# Altium project Arria10_NetBoard.PrjPcb (part 2 of 2)

## Sheet [10] - FPGA IO BANK 3A.SchDoc
size A3; DocumentNumber: 10; SheetNumber: 10; SheetTotal: 15
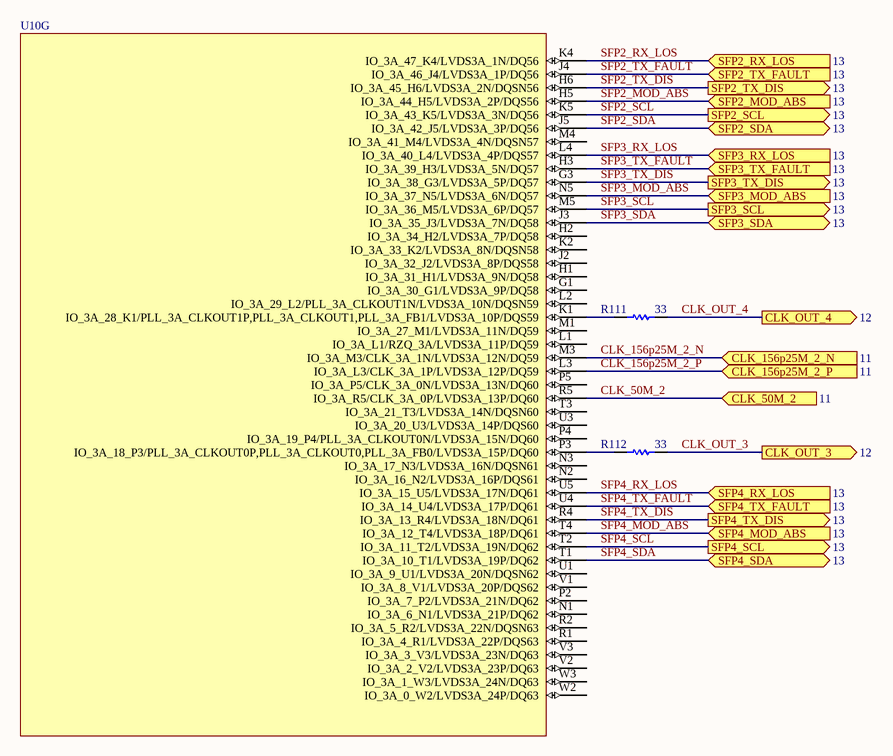
[diagram p9: [10] - FPGA IO BANK 3A.SchDoc]

### Parts
R111  33  [0402_R]
R112  33  [0402_R]
U10  10AX016 F27  [FBGA672]  (value not drawn)  (part G of 12)

### Ports
CLK_50M_2 (in, see 11), CLK_156p25M_2_N (in, see 11), CLK_156p25M_2_P (in, see 11), CLK_OUT_3 (out, see 12), CLK_OUT_4 (out, see 12), SFP2_MOD_ABS (in, see 13), SFP2_RX_LOS (in, see 13), SFP2_SCL (out, see 13), SFP2_SDA (bidir, see 13), SFP2_TX_DIS (out, see 13), SFP2_TX_FAULT (in, see 13), SFP3_MOD_ABS (in, see 13), SFP3_RX_LOS (in, see 13), SFP3_SCL (out, see 13), SFP3_SDA (bidir, see 13), SFP3_TX_DIS (out, see 13), SFP3_TX_FAULT (in, see 13), SFP4_MOD_ABS (in, see 13), SFP4_RX_LOS (in, see 13), SFP4_SCL (out, see 13), SFP4_SDA (bidir, see 13), SFP4_TX_DIS (out, see 13), SFP4_TX_FAULT (in, see 13)

### Nets
CLK_50M_2: U10.R5(IO_3A_R5/CLK_3A_0P/LVDS3A_13P/DQ60) ; port CLK_50M_2
CLK_156p25M_2_N: U10.M3(IO_3A_M3/CLK_3A_1N/LVDS3A_12N/DQ59) ; port CLK_156p25M_2_N
CLK_156p25M_2_P: U10.L3(IO_3A_L3/CLK_3A_1P/LVDS3A_12P/DQ59) ; port CLK_156p25M_2_P
CLK_OUT_3: R112.2 ; port CLK_OUT_3
CLK_OUT_4: R111.2 ; port CLK_OUT_4
SFP2_MOD_ABS: U10.H5(IO_3A_44_H5/LVDS3A_2P/DQS56) ; port SFP2_MOD_ABS
SFP2_RX_LOS: U10.K4(IO_3A_47_K4/LVDS3A_1N/DQ56) ; port SFP2_RX_LOS
SFP2_SCL: U10.K5(IO_3A_43_K5/LVDS3A_3N/DQ56) ; port SFP2_SCL
SFP2_SDA: U10.J5(IO_3A_42_J5/LVDS3A_3P/DQ56) ; port SFP2_SDA
SFP2_TX_DIS: U10.H6(IO_3A_45_H6/LVDS3A_2N/DQSN56) ; port SFP2_TX_DIS
SFP2_TX_FAULT: U10.J4(IO_3A_46_J4/LVDS3A_1P/DQ56) ; port SFP2_TX_FAULT
SFP3_MOD_ABS: U10.N5(IO_3A_37_N5/LVDS3A_6N/DQ57) ; port SFP3_MOD_ABS
SFP3_RX_LOS: U10.L4(IO_3A_40_L4/LVDS3A_4P/DQS57) ; port SFP3_RX_LOS
SFP3_SCL: U10.M5(IO_3A_36_M5/LVDS3A_6P/DQ57) ; port SFP3_SCL
SFP3_SDA: U10.J3(IO_3A_35_J3/LVDS3A_7N/DQ58) ; port SFP3_SDA
SFP3_TX_DIS: U10.G3(IO_3A_38_G3/LVDS3A_5P/DQ57) ; port SFP3_TX_DIS
SFP3_TX_FAULT: U10.H3(IO_3A_39_H3/LVDS3A_5N/DQ57) ; port SFP3_TX_FAULT
SFP4_MOD_ABS: U10.T4(IO_3A_12_T4/LVDS3A_18P/DQ61) ; port SFP4_MOD_ABS
SFP4_RX_LOS: U10.U5(IO_3A_15_U5/LVDS3A_17N/DQ61) ; port SFP4_RX_LOS
SFP4_SCL: U10.T2(IO_3A_11_T2/LVDS3A_19N/DQ62) ; port SFP4_SCL
SFP4_SDA: U10.T1(IO_3A_10_T1/LVDS3A_19P/DQ62) ; port SFP4_SDA
SFP4_TX_DIS: U10.R4(IO_3A_13_R4/LVDS3A_18N/DQ61) ; port SFP4_TX_DIS
SFP4_TX_FAULT: U10.U4(IO_3A_14_U4/LVDS3A_17P/DQ61) ; port SFP4_TX_FAULT
NetR111_1: R111.1 U10.K1(IO_3A_28_K1/PLL_3A_CLKOUT1P,PLL_3A_CLKOUT1,PLL_3A_FB1/LVDS3A_10P/DQS59)
NetR112_1: R112.1 U10.P3(IO_3A_18_P3/PLL_3A_CLKOUT0P,PLL_3A_CLKOUT0,PLL_3A_FB0/LVDS3A_15P/DQ60)

Not connected (* = marked no-connect by the designer): U10 G1(IO_3A_30_G1/LVDS3A_9P/DQ58) H1(IO_3A_31_H1/LVDS3A_9N/DQ58) H2(IO_3A_34_H2/LVDS3A_7P/DQ58) J2(IO_3A_32_J2/LVDS3A_8P/DQS58) K2(IO_3A_33_K2/LVDS3A_8N/DQSN58) L1(IO_3A_L1/RZQ_3A/LVDS3A_11P/DQ59) L2(IO_3A_29_L2/PLL_3A_CLKOUT1N/LVDS3A_10N/DQSN59) M1(IO_3A_27_M1/LVDS3A_11N/DQ59) M4(IO_3A_41_M4/LVDS3A_4N/DQSN57) N1(IO_3A_6_N1/LVDS3A_21P/DQ62) N2(IO_3A_16_N2/LVDS3A_16P/DQS61) N3(IO_3A_17_N3/LVDS3A_16N/DQSN61) P2(IO_3A_7_P2/LVDS3A_21N/DQ62) P4(IO_3A_19_P4/PLL_3A_CLKOUT0N/LVDS3A_15N/DQ60) P5(IO_3A_P5/CLK_3A_0N/LVDS3A_13N/DQ60) R1(IO_3A_4_R1/LVDS3A_22P/DQS63) R2(IO_3A_5_R2/LVDS3A_22N/DQSN63) T3(IO_3A_21_T3/LVDS3A_14N/DQSN60) U1(IO_3A_9_U1/LVDS3A_20N/DQSN62) U3(IO_3A_20_U3/LVDS3A_14P/DQS60) V1(IO_3A_8_V1/LVDS3A_20P/DQS62) V2(IO_3A_2_V2/LVDS3A_23P/DQ63) V3(IO_3A_3_V3/LVDS3A_23N/DQ63) W2(IO_3A_0_W2/LVDS3A_24P/DQ63) W3(IO_3A_1_W3/LVDS3A_24N/DQ63)

### Library data of the parts
R111 R112 = Res SMD: SMD Resistor; Tolerance: 5%; Value: 33; Manufacturer Part Num: *
U10 = 10AX016: Value: 10AX016 F27; Manufacturer Part Num: *

## Sheet [11] - MAIN CLOCKS.SchDoc
size A3; DocumentNumber: 11; SheetNumber: 11; SheetTotal: 15
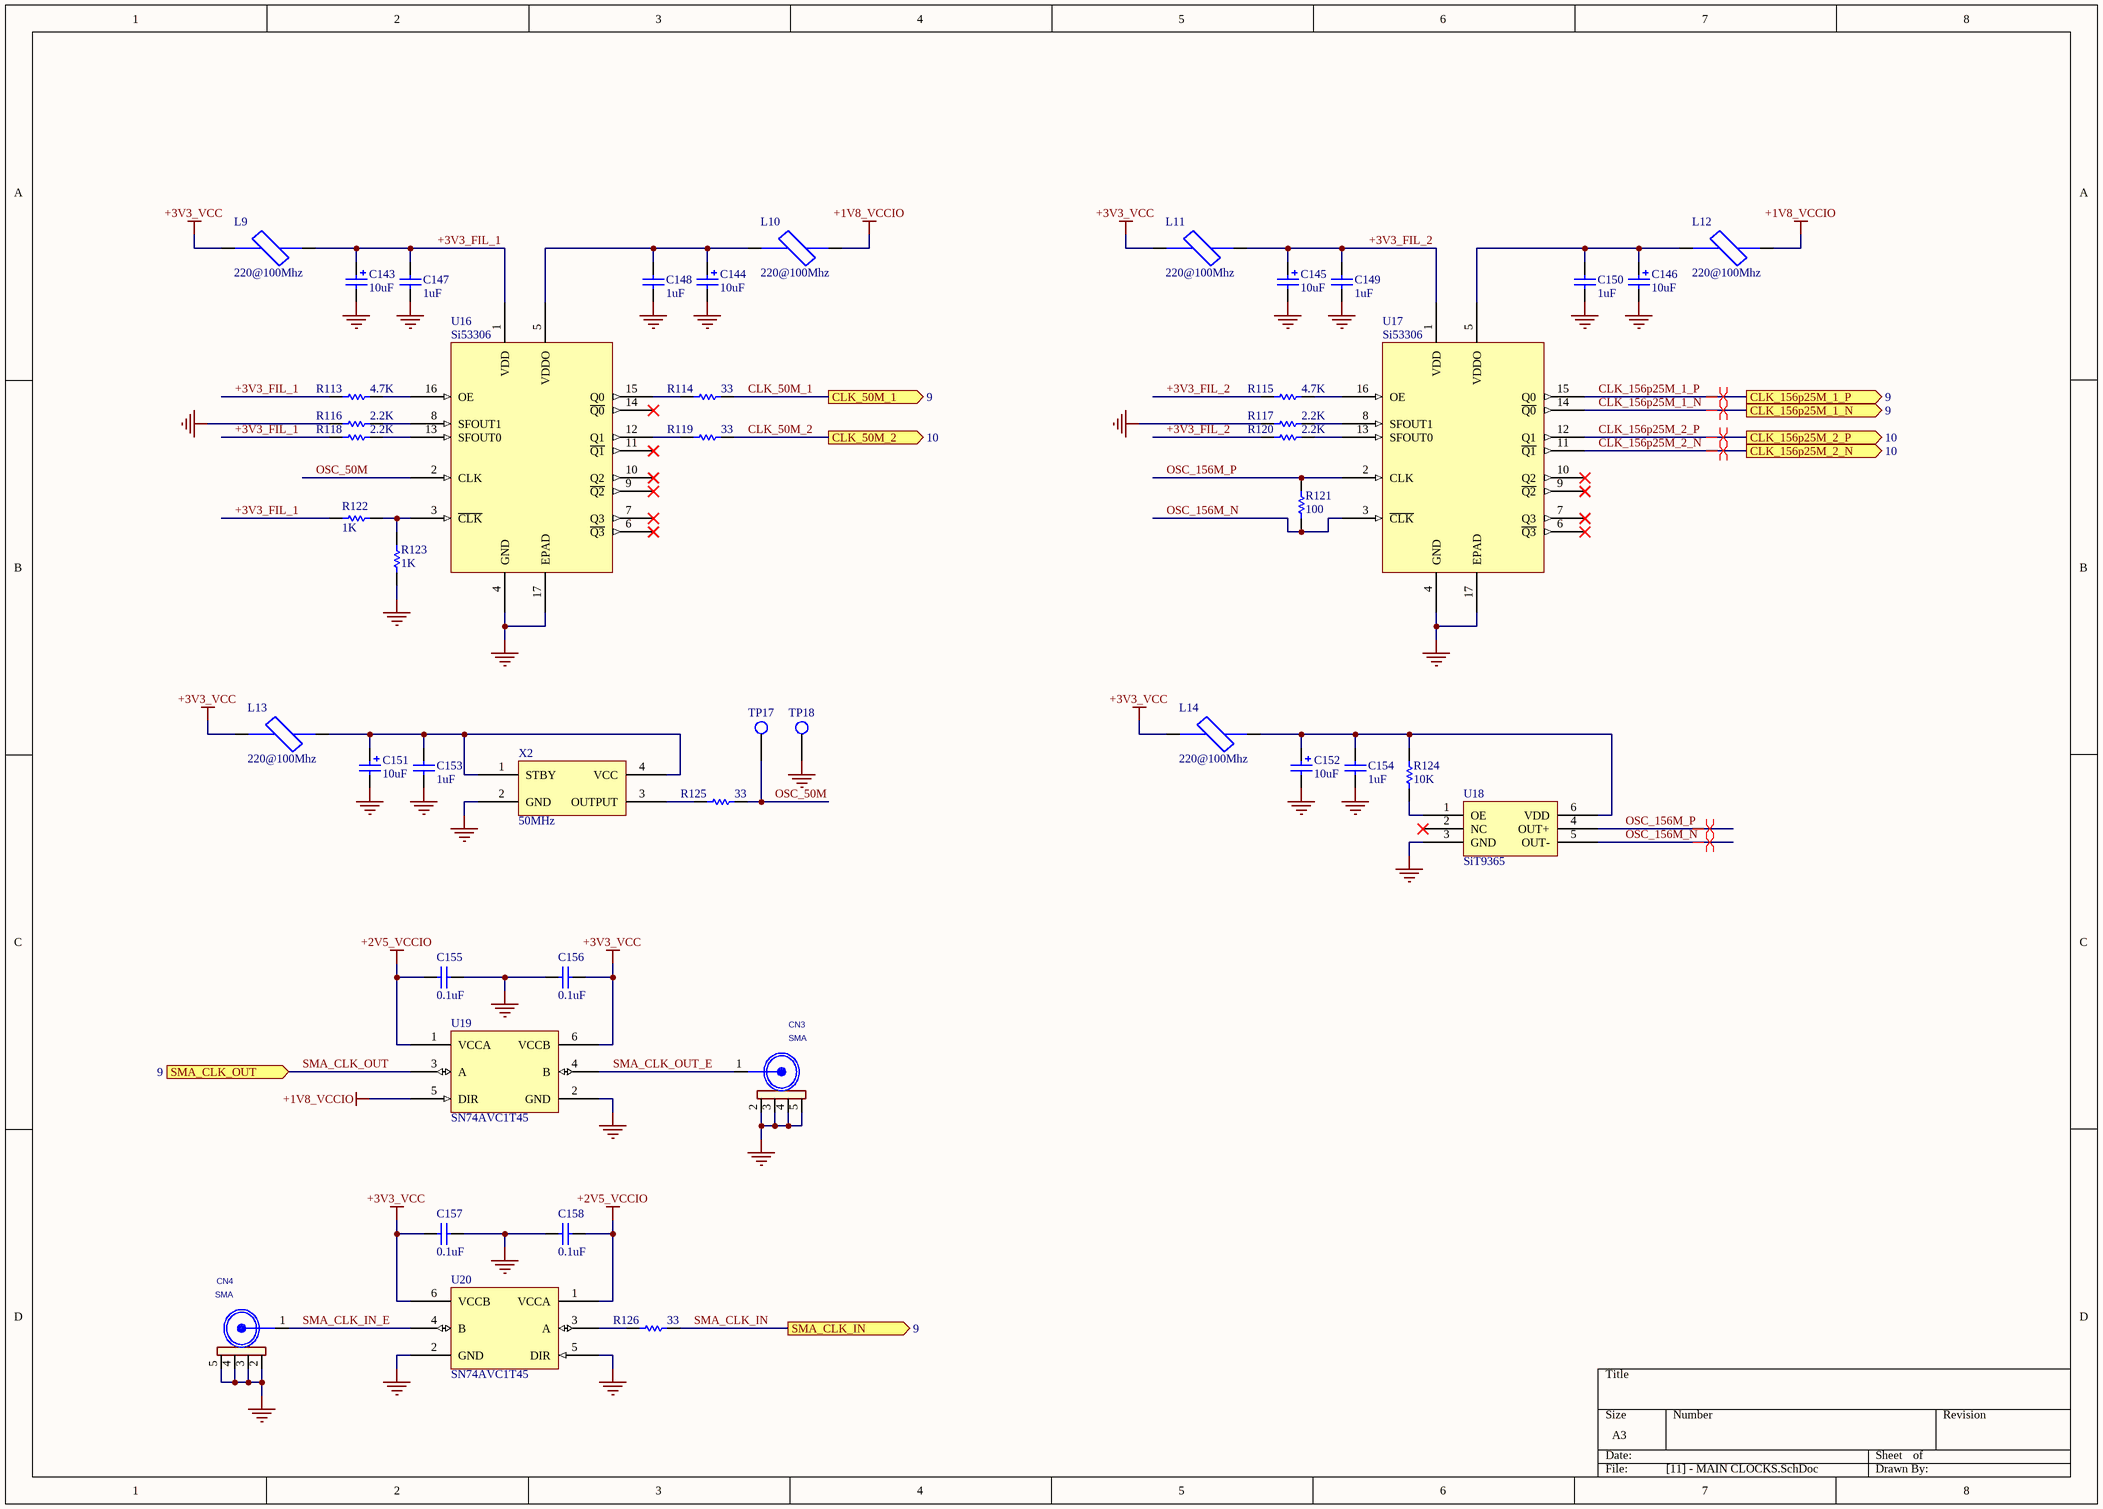
[diagram p10: [11] - MAIN CLOCKS.SchDoc]

### Parts
C143  10uF  [TANT_B]
C144  10uF  [TANT_B]
C145  10uF  [TANT_B]
C146  10uF  [TANT_B]
C147  1uF  [0402_C]
C148  1uF  [0402_C]
C149  1uF  [0402_C]
C150  1uF  [0402_C]
C151  10uF  [TANT_B]
C152  10uF  [TANT_B]
C153  1uF  [0402_C]
C154  1uF  [0402_C]
C155  0.1uF  [0402_C]
C156  0.1uF  [0402_C]
C157  0.1uF  [0402_C]
C158  0.1uF  [0402_C]
CN3  SMA  [SMA_STRAIGHT]
CN4  SMA  [SMA_STRAIGHT]
L9  220@100Mhz  [0805_L]
L10  220@100Mhz  [0805_L]
L11  220@100Mhz  [0805_L]
L12  220@100Mhz  [0805_L]
L13  220@100Mhz  [0805_L]
L14  220@100Mhz  [0805_L]
R113  4.7K  [0402_R]
R114  33  [0402_R]
R115  4.7K  [0402_R]
R116  2.2K  [0402_R]
R117  2.2K  [0402_R]
R118  2.2K  [0402_R]
R119  33  [0402_R]
R120  2.2K  [0402_R]
R121  100  [0402_R]
R122  1K  [0402_R]
R123  1K  [0402_R]
R124  10K  [0402_R]
R125  33  [0402_R]
R126  33  [0402_R]
TP17  Test Point  [PIN_1mm]  (value not drawn)
TP18  Test Point  [PIN_1mm]  (value not drawn)
U16  Si53306
U17  Si53306
U18  SiT9365
U19  SN74AVC1T45
U20  SN74AVC1T45
X2  50MHz  [OSC_3.2x2.5]

### Ports
CLK_50M_1 (out, see 9), CLK_50M_2 (out, see 10), CLK_156p25M_1_N (out, see 9), CLK_156p25M_1_P (out, see 9), CLK_156p25M_2_N (out, see 10), CLK_156p25M_2_P (out, see 10), SMA_CLK_IN (out, see 9), SMA_CLK_OUT (in, see 9)

### Nets
+1V8_VCCIO: L10.2 L12.2 U19.5(DIR)
+2V5_VCCIO: C155.2 C158.1 U19.1(VCCA) U20.1(VCCA)
+3V3_VCC: C156.1 C157.2 L9.1 L11.1 L13.1 L14.1 U19.6(VCCB) U20.6(VCCB)
GND: C143.2 C144.2 C145.2 C146.2 C147.1 C148.1 C149.1 C150.1 C151.2 C152.2 C153.1 C154.1 C155.1 C156.2 C157.1 C158.2 CN3.2 CN3.3 CN3.4 CN3.5 CN4.2 CN4.3 CN4.4 CN4.5 R116.1 R117.1 R123.1 TP18.1 U16.4(GND) U16.17(EPAD) U17.4(GND) U17.17(EPAD) U18.3(GND) U19.2(GND) U20.2(GND) U20.5(DIR) X2.2(GND)
+3V3_FIL_1: C143.1 C147.2 L9.2 R113.1 R118.1 R122.1 U16.1(VDD)
+3V3_FIL_2: C145.1 C149.2 L11.2 R115.1 R120.1 U17.1(VDD)
CLK_50M_1: R114.2 ; port CLK_50M_1
CLK_50M_2: R119.2 ; port CLK_50M_2
CLK_156p25M_1_N: U17.14(~{Q0}) ; port CLK_156p25M_1_N
CLK_156p25M_1_P: U17.15(Q0) ; port CLK_156p25M_1_P
CLK_156p25M_2_N: U17.11(~{Q1}) ; port CLK_156p25M_2_N
CLK_156p25M_2_P: U17.12(Q1) ; port CLK_156p25M_2_P
OSC_50M: R125.2 TP17.1 U16.2(CLK)
OSC_156M_N: R121.1 U17.3(~{CLK}) U18.5(OUT-)
OSC_156M_P: R121.2 U17.2(CLK) U18.4(OUT+)
SMA_CLK_IN: R126.2 ; port SMA_CLK_IN
SMA_CLK_IN_E: CN4.1 U20.4(B)
SMA_CLK_OUT: U19.3(A) ; port SMA_CLK_OUT
SMA_CLK_OUT_E: CN3.1 U19.4(B)
NetC144_1: C144.1 C148.2 L10.1 U16.5(VDDO)
NetC146_1: C146.1 C150.2 L12.1 U17.5(VDDO)
NetC151_1: C151.1 C153.2 L13.2 X2.1(STBY) X2.4(VCC)
NetC152_1: C152.1 C154.2 L14.2 R124.2 U18.6(VDD)
NetR113_2: R113.2 U16.16(OE)
NetR114_1: R114.1 U16.15(Q0)
NetR115_2: R115.2 U17.16(OE)
NetR116_2: R116.2 U16.8(SFOUT1)
NetR117_2: R117.2 U17.8(SFOUT1)
NetR118_2: R118.2 U16.13(SFOUT0)
NetR119_1: R119.1 U16.12(Q1)
NetR120_2: R120.2 U17.13(SFOUT0)
NetR122_2: R122.2 R123.2 U16.3(~{CLK})
NetR124_1: R124.1 U18.1(OE)
NetR125_1: R125.1 X2.3(OUTPUT)
NetR126_1: R126.1 U20.3(A)

Not connected (* = marked no-connect by the designer): U16 6(~{Q3})* 7(Q3)* 9(~{Q2})* 10(Q2)* 11(~{Q1})* 14(~{Q0})*; U17 6(~{Q3})* 7(Q3)* 9(~{Q2})* 10(Q2)*; U18 2(NC)*

### Layout directives
differential pair: CLK_156p25M_1_N, CLK_156p25M_1_P, CLK_156p25M_2_N, CLK_156p25M_2_P, OSC_156M_N, OSC_156M_P

### Library data of the parts
C143-C146 C151 C152 = Cap Tant: Tantalum Polarized Capacitor; RATED_VOLTAGE: 6.3V; Value: 10uF
C147-C150 C153 C154 = Cap SMD: Non-Pol SMD Capacitor; RATED_VOLTAGE: 16V; Value: 1uF; Manufacturer Part Num: *; Dielectric: *
C155-C158 = Cap SMD: Non-Pol SMD Capacitor; RATED_VOLTAGE: 25V; Value: 0.1uF; Manufacturer Part Num: *; Dielectric: *
CN3 CN4 = SMA Straight: CONN -  SMA VERTICAL GOLD PLATED SMT CENTER CONDUCTOR; Value: SMA; Manufacturer Part Num: *
L9-L14 = Ferrite Bead: Value: 220@100Mhz
R113-R126 = Res SMD: SMD Resistor; Tolerance: 5%; Manufacturer Part Num: *
  R113 R115: Value: 4.7K
  R114 R119 R125 R126: Value: 33
  R116-R118 R120: Value: 2.2K
  R121: Value: 100
  R122 R123: Value: 1K
  R124: Value: 10K
TP17 TP18 = Test Point: Test Point Footprint; Value: Test Point
U16 U17 = Si53306: Ultra-Low Additive Jitter Fanout Clock Buffer; Manufacturer Part Num: Si53306-B-GM; Value: Si53306
U18 = SiT9365: Standard Frequency Ultra-low Jitter Differential Oscillator; Manufacturer Part Num: SIT9365AC-2B2-33E156.250000G; Value: SiT9365
U19 U20 = SN74AVC1T45: Single-Bit Dual-Supply Bus Transceiver With Configurable Voltage Translation; Value: SN74AVC1T45; Manufacturer Part Num: *
X2 = XTAL OSC: Crystal Oscillator; Value: 50MHz

## Sheet [12] - REFERENCE CLOCKS.SchDoc
size A3; DocumentNumber: 12; SheetNumber: 12; SheetTotal: 15
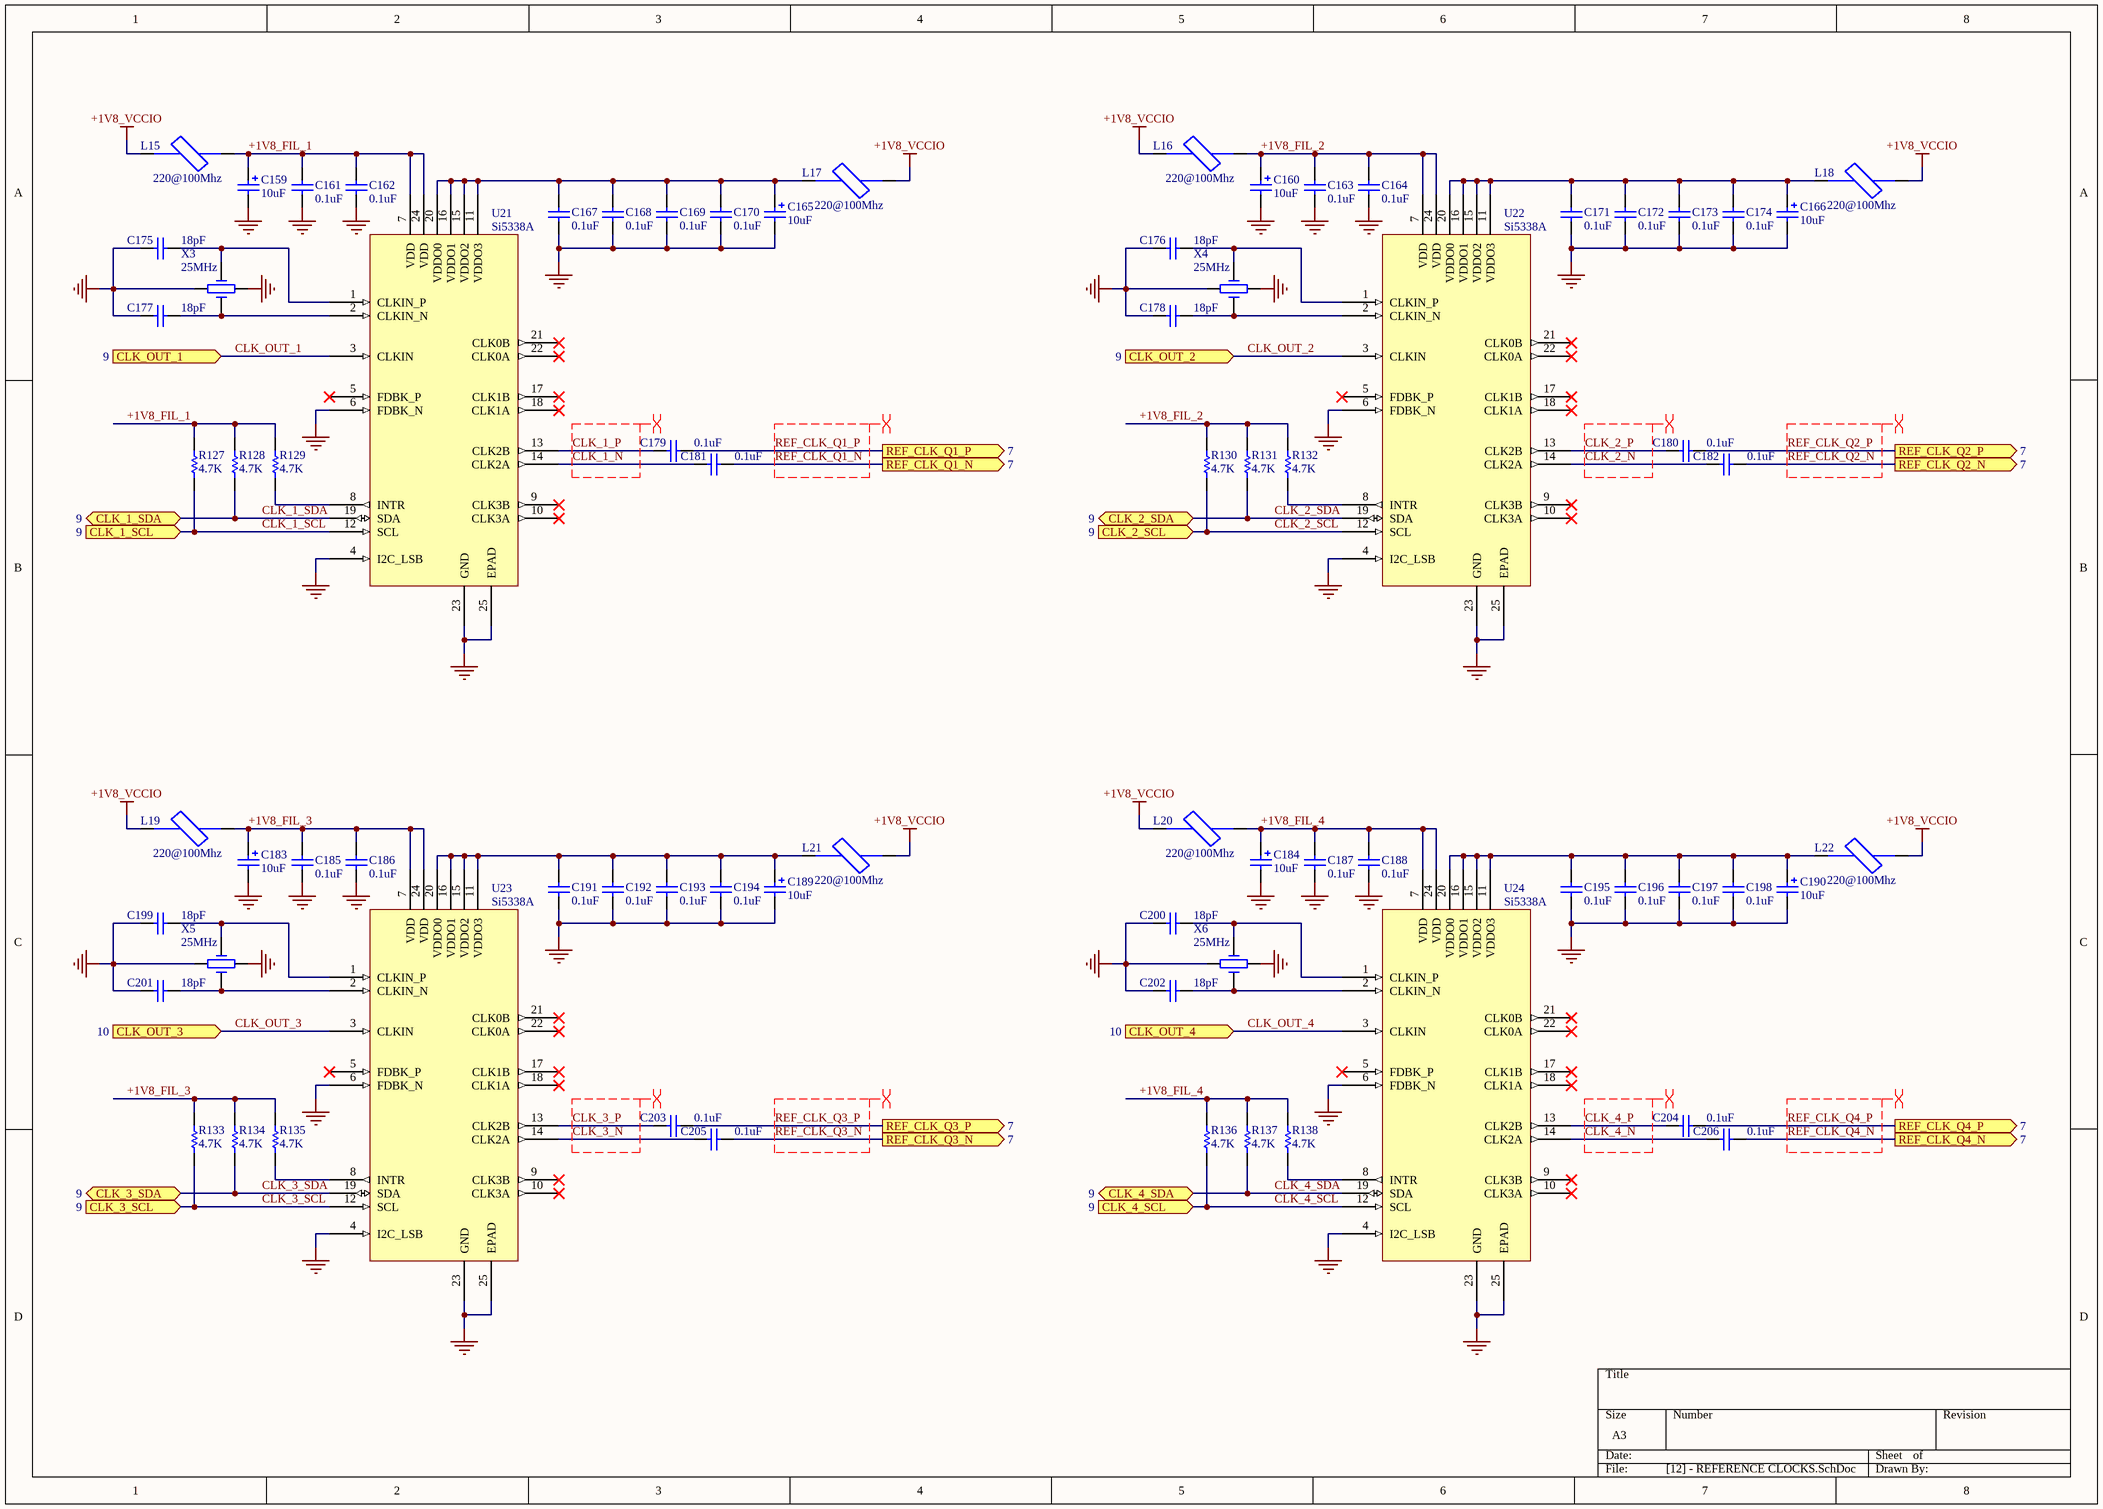
[diagram p11: [12] - REFERENCE CLOCKS.SchDoc]

### Parts
C159  10uF  [TANT_B]
C160  10uF  [TANT_B]
C161  0.1uF  [0402_C]
C162  0.1uF  [0402_C]
C163  0.1uF  [0402_C]
C164  0.1uF  [0402_C]
C165  10uF  [TANT_B]
C166  10uF  [TANT_B]
C167  0.1uF  [0402_C]
C168  0.1uF  [0402_C]
C169  0.1uF  [0402_C]
C170  0.1uF  [0402_C]
C171  0.1uF  [0402_C]
C172  0.1uF  [0402_C]
C173  0.1uF  [0402_C]
C174  0.1uF  [0402_C]
C175  18pF  [0402_C]
C176  18pF  [0402_C]
C177  18pF  [0402_C]
C178  18pF  [0402_C]
C179  0.1uF  [0402_C]
C180  0.1uF  [0402_C]
C181  0.1uF  [0402_C]
C182  0.1uF  [0402_C]
C183  10uF  [TANT_B]
C184  10uF  [TANT_B]
C185  0.1uF  [0402_C]
C186  0.1uF  [0402_C]
C187  0.1uF  [0402_C]
C188  0.1uF  [0402_C]
C189  10uF  [TANT_B]
C190  10uF  [TANT_B]
C191  0.1uF  [0402_C]
C192  0.1uF  [0402_C]
C193  0.1uF  [0402_C]
C194  0.1uF  [0402_C]
C195  0.1uF  [0402_C]
C196  0.1uF  [0402_C]
C197  0.1uF  [0402_C]
C198  0.1uF  [0402_C]
C199  18pF  [0402_C]
C200  18pF  [0402_C]
C201  18pF  [0402_C]
C202  18pF  [0402_C]
C203  0.1uF  [0402_C]
C204  0.1uF  [0402_C]
C205  0.1uF  [0402_C]
C206  0.1uF  [0402_C]
L15  220@100Mhz  [0805_L]
L16  220@100Mhz  [0805_L]
L17  220@100Mhz  [0805_L]
L18  220@100Mhz  [0805_L]
L19  220@100Mhz  [0805_L]
L20  220@100Mhz  [0805_L]
L21  220@100Mhz  [0805_L]
L22  220@100Mhz  [0805_L]
R127  4.7K  [0402_R]
R128  4.7K  [0402_R]
R129  4.7K  [0402_R]
R130  4.7K  [0402_R]
R131  4.7K  [0402_R]
R132  4.7K  [0402_R]
R133  4.7K  [0402_R]
R134  4.7K  [0402_R]
R135  4.7K  [0402_R]
R136  4.7K  [0402_R]
R137  4.7K  [0402_R]
R138  4.7K  [0402_R]
U21  Si5338A
U22  Si5338A
U23  Si5338A
U24  Si5338A
X3  25MHz  [OSC_3.2x2.5]
X4  25MHz  [OSC_3.2x2.5]
X5  25MHz  [OSC_3.2x2.5]
X6  25MHz  [OSC_3.2x2.5]

### Ports
CLK_1_SCL (in, see 9), CLK_1_SDA (bidir, see 9), CLK_2_SCL (in, see 9), CLK_2_SDA (bidir, see 9), CLK_3_SCL (in, see 9), CLK_3_SDA (bidir, see 9), CLK_4_SCL (in, see 9), CLK_4_SDA (bidir, see 9), CLK_OUT_1 (in, see 9), CLK_OUT_2 (in, see 9), CLK_OUT_3 (in, see 10), CLK_OUT_4 (in, see 10), REF_CLK_Q1_N (out, see 7), REF_CLK_Q1_P (out, see 7), REF_CLK_Q2_N (out, see 7), REF_CLK_Q2_P (out, see 7), REF_CLK_Q3_N (out, see 7), REF_CLK_Q3_P (out, see 7), REF_CLK_Q4_N (out, see 7), REF_CLK_Q4_P (out, see 7)

### Nets
+1V8_VCCIO: L15.1 L16.1 L17.2 L18.2 L19.1 L20.1 L21.2 L22.2
GND: C159.2 C160.2 C161.1 C162.1 C163.1 C164.1 C165.2 C166.2 C167.1 C168.1 C169.1 C170.1 C171.1 C172.1 C173.1 C174.1 C175.1 C176.1 C177.1 C178.1 C183.2 C184.2 C185.1 C186.1 C187.1 C188.1 C189.2 C190.2 C191.1 C192.1 C193.1 C194.1 C195.1 C196.1 C197.1 C198.1 C199.1 C200.1 C201.1 C202.1 U21.4(I2C_LSB) U21.6(FDBK_N) U21.23(GND) U21.25(EPAD) U22.4(I2C_LSB) U22.6(FDBK_N) U22.23(GND) U22.25(EPAD) U23.4(I2C_LSB) U23.6(FDBK_N) U23.23(GND) U23.25(EPAD) U24.4(I2C_LSB) U24.6(FDBK_N) U24.23(GND) U24.25(EPAD) X3.2(GND1) X3.4(GND2) X4.2(GND1) X4.4(GND2) X5.2(GND1) X5.4(GND2) X6.2(GND1) X6.4(GND2)
+1V8_FIL_1: C159.1 C161.2 C162.2 L15.2 R127.2 R128.2 R129.2 U21.7(VDD) U21.24(VDD)
+1V8_FIL_2: C160.1 C163.2 C164.2 L16.2 R130.2 R131.2 R132.2 U22.7(VDD) U22.24(VDD)
+1V8_FIL_3: C183.1 C185.2 C186.2 L19.2 R133.2 R134.2 R135.2 U23.7(VDD) U23.24(VDD)
+1V8_FIL_4: C184.1 C187.2 C188.2 L20.2 R136.2 R137.2 R138.2 U24.7(VDD) U24.24(VDD)
CLK_1_N: C181.1 U21.14(CLK2A)
CLK_1_P: C179.1 U21.13(CLK2B)
CLK_1_SCL: R127.1 U21.12(SCL) ; port CLK_1_SCL
CLK_1_SDA: R128.1 U21.19(SDA) ; port CLK_1_SDA
CLK_2_N: C182.1 U22.14(CLK2A)
CLK_2_P: C180.1 U22.13(CLK2B)
CLK_2_SCL: R130.1 U22.12(SCL) ; port CLK_2_SCL
CLK_2_SDA: R131.1 U22.19(SDA) ; port CLK_2_SDA
CLK_3_N: C205.1 U23.14(CLK2A)
CLK_3_P: C203.1 U23.13(CLK2B)
CLK_3_SCL: R133.1 U23.12(SCL) ; port CLK_3_SCL
CLK_3_SDA: R134.1 U23.19(SDA) ; port CLK_3_SDA
CLK_4_N: C206.1 U24.14(CLK2A)
CLK_4_P: C204.1 U24.13(CLK2B)
CLK_4_SCL: R136.1 U24.12(SCL) ; port CLK_4_SCL
CLK_4_SDA: R137.1 U24.19(SDA) ; port CLK_4_SDA
CLK_OUT_1: U21.3(CLKIN) ; port CLK_OUT_1
CLK_OUT_2: U22.3(CLKIN) ; port CLK_OUT_2
CLK_OUT_3: U23.3(CLKIN) ; port CLK_OUT_3
CLK_OUT_4: U24.3(CLKIN) ; port CLK_OUT_4
REF_CLK_Q1_N: C181.2 ; port REF_CLK_Q1_N
REF_CLK_Q1_P: C179.2 ; port REF_CLK_Q1_P
REF_CLK_Q2_N: C182.2 ; port REF_CLK_Q2_N
REF_CLK_Q2_P: C180.2 ; port REF_CLK_Q2_P
REF_CLK_Q3_N: C205.2 ; port REF_CLK_Q3_N
REF_CLK_Q3_P: C203.2 ; port REF_CLK_Q3_P
REF_CLK_Q4_N: C206.2 ; port REF_CLK_Q4_N
REF_CLK_Q4_P: C204.2 ; port REF_CLK_Q4_P
NetC165_1: C165.1 C167.2 C168.2 C169.2 C170.2 L17.1 U21.11(VDDO3) U21.15(VDDO2) U21.16(VDDO1) U21.20(VDDO0)
NetC166_1: C166.1 C171.2 C172.2 C173.2 C174.2 L18.1 U22.11(VDDO3) U22.15(VDDO2) U22.16(VDDO1) U22.20(VDDO0)
NetC175_2: C175.2 U21.1(CLKIN_P) X3.1(OSC1)
NetC176_2: C176.2 U22.1(CLKIN_P) X4.1(OSC1)
NetC177_2: C177.2 U21.2(CLKIN_N) X3.3(OSC2)
NetC178_2: C178.2 U22.2(CLKIN_N) X4.3(OSC2)
NetC189_1: C189.1 C191.2 C192.2 C193.2 C194.2 L21.1 U23.11(VDDO3) U23.15(VDDO2) U23.16(VDDO1) U23.20(VDDO0)
NetC190_1: C190.1 C195.2 C196.2 C197.2 C198.2 L22.1 U24.11(VDDO3) U24.15(VDDO2) U24.16(VDDO1) U24.20(VDDO0)
NetC199_2: C199.2 U23.1(CLKIN_P) X5.1(OSC1)
NetC200_2: C200.2 U24.1(CLKIN_P) X6.1(OSC1)
NetC201_2: C201.2 U23.2(CLKIN_N) X5.3(OSC2)
NetC202_2: C202.2 U24.2(CLKIN_N) X6.3(OSC2)
NetR129_1: R129.1 U21.8(INTR)
NetR132_1: R132.1 U22.8(INTR)
NetR135_1: R135.1 U23.8(INTR)
NetR138_1: R138.1 U24.8(INTR)

Not connected (* = marked no-connect by the designer): U21 5(FDBK_P)* 9(CLK3B)* 10(CLK3A)* 17(CLK1B)* 18(CLK1A)* 21(CLK0B)* 22(CLK0A)*; U22 5(FDBK_P)* 9(CLK3B)* 10(CLK3A)* 17(CLK1B)* 18(CLK1A)* 21(CLK0B)* 22(CLK0A)*; U23 5(FDBK_P)* 9(CLK3B)* 10(CLK3A)* 17(CLK1B)* 18(CLK1A)* 21(CLK0B)* 22(CLK0A)*; U24 5(FDBK_P)* 9(CLK3B)* 10(CLK3A)* 17(CLK1B)* 18(CLK1A)* 21(CLK0B)* 22(CLK0A)*

### Layout directives
differential pair; differential pair class DIFF100: CLK_1_N, CLK_1_P, CLK_2_N, CLK_2_P, CLK_3_N, CLK_3_P, CLK_4_N, CLK_4_P, REF_CLK_Q1_N, REF_CLK_Q1_P, REF_CLK_Q2_N, REF_CLK_Q2_P, REF_CLK_Q3_N, REF_CLK_Q3_P, REF_CLK_Q4_N, REF_CLK_Q4_P

### Library data of the parts
C159 C160 C165 C166 C183 C184 C189 C190 = Cap Tant: as C143-C146 on sheet [11] - MAIN CLOCKS; Value: 10uF
C161-C164 C167-C182 C185-C188 C191-C206 = Cap SMD: as C147-C150 on sheet [11] - MAIN CLOCKS; Manufacturer Part Num: *; Dielectric: *
  C161-C164 C167-C174 C179-C182 C185-C188 C191-C198 C203-C206: Value: 0.1uF
  C175-C178 C199-C202: Value: 18pF
L15-L22 = Ferrite Bead: Value: 220@100Mhz
R127-R138 = Res SMD: SMD Resistor; Tolerance: 5%; Value: 4.7K; Manufacturer Part Num: *
U21-U24 = Si5338: I2C-Programmable Any-Frequency, Any-Output Quad Clock Generator; Value: Si5338A; Manufacturer Part Num: *
X3-X6 = XTAL 4pin: 4-pin SMD Crystal; Manufacturer Part Num: ABM3B-25.000MHZ-D2Y-T; Value: 25MHz

## Sheet [13] - SFP+ MODULES.SchDoc
size A2; DocumentNumber: 13; SheetNumber: 13; SheetTotal: 15
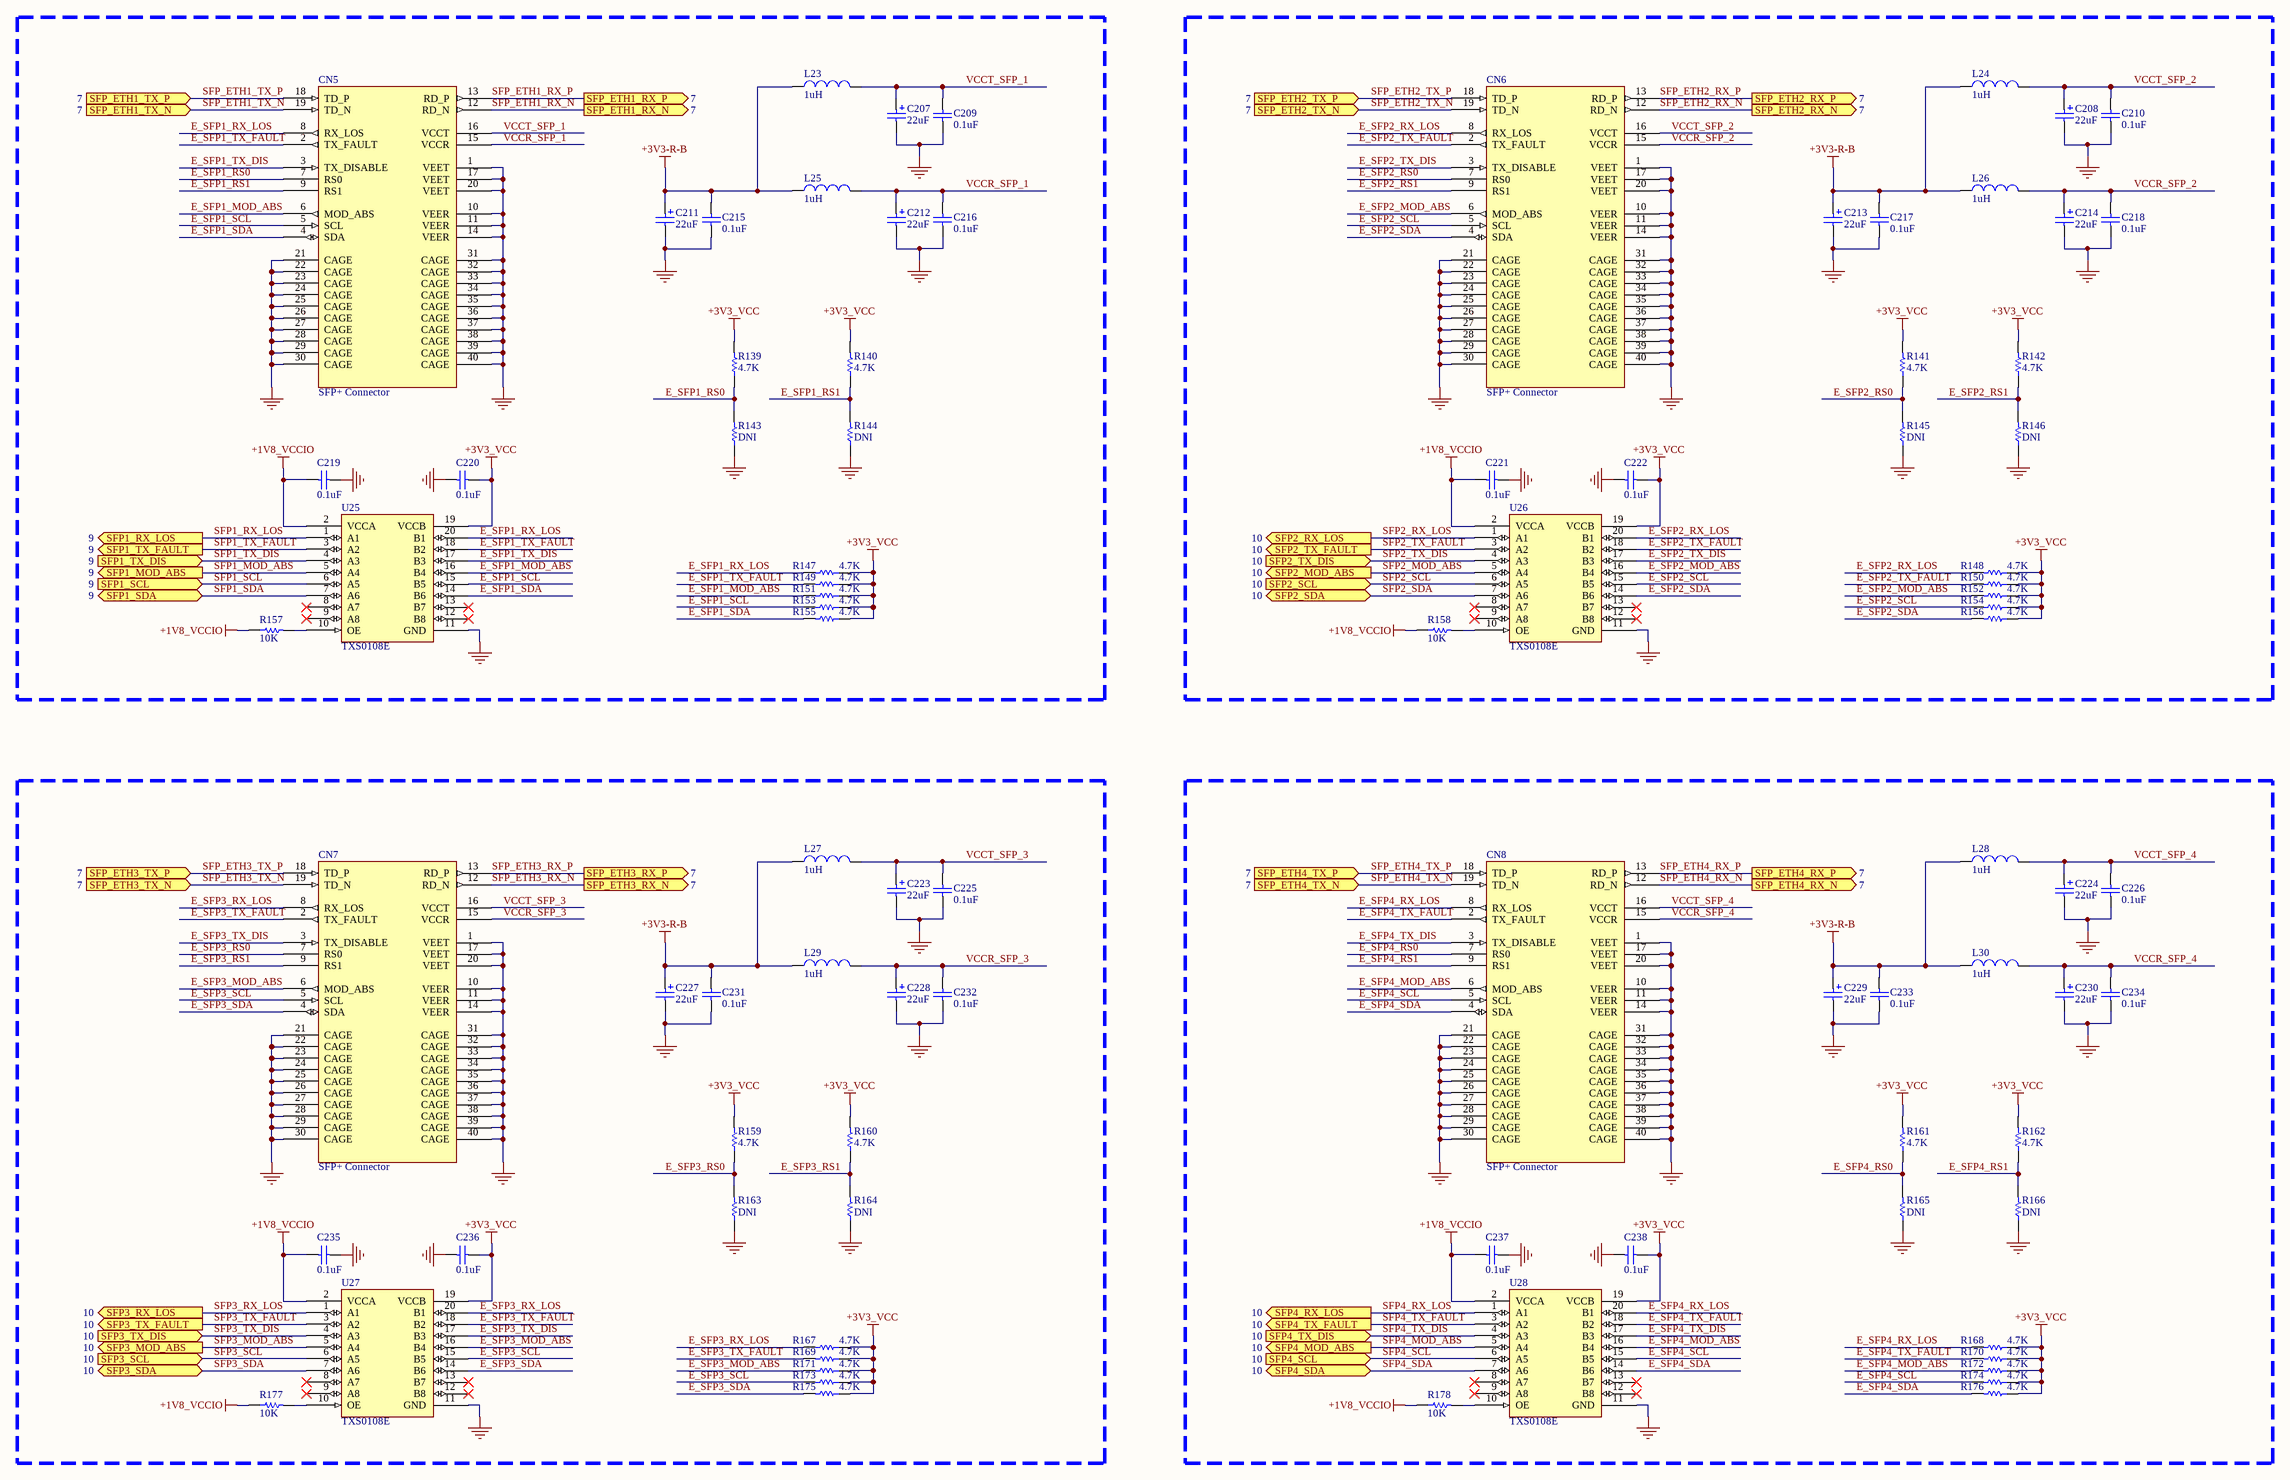
[diagram p12: [13] - SFP+ MODULES.SchDoc]

### Parts
C207  22uF  [WCAP-ASLL_8x10.5]
C208  22uF  [WCAP-ASLL_8x10.5]
C209  0.1uF  [0402_C]
C210  0.1uF  [0402_C]
C211  22uF  [WCAP-ASLL_8x10.5]
C212  22uF  [WCAP-ASLL_8x10.5]
C213  22uF  [WCAP-ASLL_8x10.5]
C214  22uF  [WCAP-ASLL_8x10.5]
C215  0.1uF  [0402_C]
C216  0.1uF  [0402_C]
C217  0.1uF  [0402_C]
C218  0.1uF  [0402_C]
C219  0.1uF  [0402_C]
C220  0.1uF  [0402_C]
C221  0.1uF  [0402_C]
C222  0.1uF  [0402_C]
C223  22uF  [WCAP-ASLL_8x10.5]
C224  22uF  [WCAP-ASLL_8x10.5]
C225  0.1uF  [0402_C]
C226  0.1uF  [0402_C]
C227  22uF  [WCAP-ASLL_8x10.5]
C228  22uF  [WCAP-ASLL_8x10.5]
C229  22uF  [WCAP-ASLL_8x10.5]
C230  22uF  [WCAP-ASLL_8x10.5]
C231  0.1uF  [0402_C]
C232  0.1uF  [0402_C]
C233  0.1uF  [0402_C]
C234  0.1uF  [0402_C]
C235  0.1uF  [0402_C]
C236  0.1uF  [0402_C]
C237  0.1uF  [0402_C]
C238  0.1uF  [0402_C]
CN5  SFP+ Connector
CN6  SFP+ Connector
CN7  SFP+ Connector
CN8  SFP+ Connector
L23  1uH  [0402_R]
L24  1uH  [0402_R]
L25  1uH  [0402_R]
L26  1uH  [0402_R]
L27  1uH  [0402_R]
L28  1uH  [0402_R]
L29  1uH  [0402_R]
L30  1uH  [0402_R]
R139  4.7K  [0805_R]
R140  4.7K  [0805_R]
R141  4.7K  [0805_R]
R142  4.7K  [0805_R]
R143  DNI  [0805_R]
R144  DNI  [0805_R]
R145  DNI  [0805_R]
R146  DNI  [0805_R]
R147  4.7K  [0805_R]
R148  4.7K  [0805_R]
R149  4.7K  [0805_R]
R150  4.7K  [0805_R]
R151  4.7K  [0805_R]
R152  4.7K  [0805_R]
R153  4.7K  [0805_R]
R154  4.7K  [0805_R]
R155  4.7K  [0805_R]
R156  4.7K  [0805_R]
R157  10K  [0402_R]
R158  10K  [0402_R]
R159  4.7K  [0805_R]
R160  4.7K  [0805_R]
R161  4.7K  [0805_R]
R162  4.7K  [0805_R]
R163  DNI  [0805_R]
R164  DNI  [0805_R]
R165  DNI  [0805_R]
R166  DNI  [0805_R]
R167  4.7K  [0805_R]
R168  4.7K  [0805_R]
R169  4.7K  [0805_R]
R170  4.7K  [0805_R]
R171  4.7K  [0805_R]
R172  4.7K  [0805_R]
R173  4.7K  [0805_R]
R174  4.7K  [0805_R]
R175  4.7K  [0805_R]
R176  4.7K  [0805_R]
R177  10K  [0402_R]
R178  10K  [0402_R]
U25  TXS0108E
U26  TXS0108E
U27  TXS0108E
U28  TXS0108E

### Ports
SFP1_MOD_ABS (out, see 9), SFP1_RX_LOS (out, see 9), SFP1_SCL (in, see 9), SFP1_SDA (bidir, see 9), SFP1_TX_DIS (in, see 9), SFP1_TX_FAULT (out, see 9), SFP2_MOD_ABS (out, see 10), SFP2_RX_LOS (out, see 10), SFP2_SCL (in, see 10), SFP2_SDA (bidir, see 10), SFP2_TX_DIS (in, see 10), SFP2_TX_FAULT (out, see 10), SFP3_MOD_ABS (out, see 10), SFP3_RX_LOS (out, see 10), SFP3_SCL (in, see 10), SFP3_SDA (bidir, see 10), SFP3_TX_DIS (in, see 10), SFP3_TX_FAULT (out, see 10), SFP4_MOD_ABS (out, see 10), SFP4_RX_LOS (out, see 10), SFP4_SCL (in, see 10), SFP4_SDA (bidir, see 10), SFP4_TX_DIS (in, see 10), SFP4_TX_FAULT (out, see 10), SFP_ETH1_RX_N (out, see 7), SFP_ETH1_RX_P (out, see 7), SFP_ETH1_TX_N (in, see 7), SFP_ETH1_TX_P (in, see 7), SFP_ETH2_RX_N (out, see 7), SFP_ETH2_RX_P (out, see 7), SFP_ETH2_TX_N (in, see 7), SFP_ETH2_TX_P (in, see 7), SFP_ETH3_RX_N (out, see 7), SFP_ETH3_RX_P (out, see 7), SFP_ETH3_TX_N (in, see 7), SFP_ETH3_TX_P (in, see 7), SFP_ETH4_RX_N (out, see 7), SFP_ETH4_RX_P (out, see 7), SFP_ETH4_TX_N (in, see 7), SFP_ETH4_TX_P (in, see 7)

### Nets
+1V8_VCCIO: C219.2 C221.2 C235.2 C237.2 R157.1 R158.1 R177.1 R178.1 U25.2(VCCA) U26.2(VCCA) U27.2(VCCA) U28.2(VCCA)
+3V3-R-B: C211.1 C213.1 C215.1 C217.1 C227.1 C229.1 C231.1 C233.1 L23.1 L24.1 L25.1 L26.1 L27.1 L28.1 L29.1 L30.1
+3V3_VCC: C220.1 C222.1 C236.1 C238.1 R139.2 R140.2 R141.2 R142.2 R147.1 R148.1 R149.1 R150.1 R151.1 R152.1 R153.1 R154.1 R155.1 R156.1 R159.2 R160.2 R161.2 R162.2 R167.1 R168.1 R169.1 R170.1 R171.1 R172.1 R173.1 R174.1 R175.1 R176.1 U25.19(VCCB) U26.19(VCCB) U27.19(VCCB) U28.19(VCCB)
GND: C207.2 C208.2 C209.2 C210.2 C211.2 C212.2 C213.2 C214.2 C215.2 C216.2 C217.2 C218.2 C219.1 C220.2 C221.1 C222.2 C223.2 C224.2 C225.2 C226.2 C227.2 C228.2 C229.2 C230.2 C231.2 C232.2 C233.2 C234.2 C235.1 C236.2 C237.1 C238.2 CN5.1(VEET) CN5.10(VEER) CN5.11(VEER) CN5.14(VEER) CN5.17(VEET) CN5.20(VEET) CN5.21(CAGE) CN5.22(CAGE) CN5.23(CAGE) CN5.24(CAGE) CN5.25(CAGE) CN5.26(CAGE) CN5.27(CAGE) CN5.28(CAGE) CN5.29(CAGE) CN5.30(CAGE) CN5.31(CAGE) CN5.32(CAGE) CN5.33(CAGE) CN5.34(CAGE) CN5.35(CAGE) CN5.36(CAGE) CN5.37(CAGE) CN5.38(CAGE) CN5.39(CAGE) CN5.40(CAGE) CN6.1(VEET) CN6.10(VEER) CN6.11(VEER) CN6.14(VEER) CN6.17(VEET) CN6.20(VEET) CN6.21(CAGE) CN6.22(CAGE) CN6.23(CAGE) CN6.24(CAGE) CN6.25(CAGE) CN6.26(CAGE) CN6.27(CAGE) CN6.28(CAGE) CN6.29(CAGE) CN6.30(CAGE) CN6.31(CAGE) CN6.32(CAGE) CN6.33(CAGE) CN6.34(CAGE) CN6.35(CAGE) CN6.36(CAGE) CN6.37(CAGE) CN6.38(CAGE) CN6.39(CAGE) CN6.40(CAGE) CN7.1(VEET) CN7.10(VEER) CN7.11(VEER) CN7.14(VEER) CN7.17(VEET) CN7.20(VEET) CN7.21(CAGE) CN7.22(CAGE) CN7.23(CAGE) CN7.24(CAGE) CN7.25(CAGE) CN7.26(CAGE) CN7.27(CAGE) CN7.28(CAGE) CN7.29(CAGE) CN7.30(CAGE) CN7.31(CAGE) CN7.32(CAGE) CN7.33(CAGE) CN7.34(CAGE) CN7.35(CAGE) CN7.36(CAGE) CN7.37(CAGE) CN7.38(CAGE) CN7.39(CAGE) CN7.40(CAGE) CN8.1(VEET) CN8.10(VEER) CN8.11(VEER) CN8.14(VEER) CN8.17(VEET) CN8.20(VEET) CN8.21(CAGE) CN8.22(CAGE) CN8.23(CAGE) CN8.24(CAGE) CN8.25(CAGE) CN8.26(CAGE) CN8.27(CAGE) CN8.28(CAGE) CN8.29(CAGE) CN8.30(CAGE) CN8.31(CAGE) CN8.32(CAGE) CN8.33(CAGE) CN8.34(CAGE) CN8.35(CAGE) CN8.36(CAGE) CN8.37(CAGE) CN8.38(CAGE) CN8.39(CAGE) CN8.40(CAGE) R143.1 R144.1 R145.1 R146.1 R163.1 R164.1 R165.1 R166.1 U25.11(GND) U26.11(GND) U27.11(GND) U28.11(GND)
E_SFP1_MOD_ABS: CN5.6(MOD_ABS) R151.2 U25.16(B4)
E_SFP1_RS0: CN5.7(RS0) R139.1 R143.2
E_SFP1_RS1: CN5.9(RS1) R140.1 R144.2
E_SFP1_RX_LOS: CN5.8(RX_LOS) R147.2 U25.20(B1)
E_SFP1_SCL: CN5.5(SCL) R153.2 U25.15(B5)
E_SFP1_SDA: CN5.4(SDA) R155.2 U25.14(B6)
E_SFP1_TX_DIS: CN5.3(TX_DISABLE) U25.17(B3)
E_SFP1_TX_FAULT: CN5.2(TX_FAULT) R149.2 U25.18(B2)
E_SFP2_MOD_ABS: CN6.6(MOD_ABS) R152.2 U26.16(B4)
E_SFP2_RS0: CN6.7(RS0) R141.1 R145.2
E_SFP2_RS1: CN6.9(RS1) R142.1 R146.2
E_SFP2_RX_LOS: CN6.8(RX_LOS) R148.2 U26.20(B1)
E_SFP2_SCL: CN6.5(SCL) R154.2 U26.15(B5)
E_SFP2_SDA: CN6.4(SDA) R156.2 U26.14(B6)
E_SFP2_TX_DIS: CN6.3(TX_DISABLE) U26.17(B3)
E_SFP2_TX_FAULT: CN6.2(TX_FAULT) R150.2 U26.18(B2)
E_SFP3_MOD_ABS: CN7.6(MOD_ABS) R171.2 U27.16(B4)
E_SFP3_RS0: CN7.7(RS0) R159.1 R163.2
E_SFP3_RS1: CN7.9(RS1) R160.1 R164.2
E_SFP3_RX_LOS: CN7.8(RX_LOS) R167.2 U27.20(B1)
E_SFP3_SCL: CN7.5(SCL) R173.2 U27.15(B5)
E_SFP3_SDA: CN7.4(SDA) R175.2 U27.14(B6)
E_SFP3_TX_DIS: CN7.3(TX_DISABLE) U27.17(B3)
E_SFP3_TX_FAULT: CN7.2(TX_FAULT) R169.2 U27.18(B2)
E_SFP4_MOD_ABS: CN8.6(MOD_ABS) R172.2 U28.16(B4)
E_SFP4_RS0: CN8.7(RS0) R161.1 R165.2
E_SFP4_RS1: CN8.9(RS1) R162.1 R166.2
E_SFP4_RX_LOS: CN8.8(RX_LOS) R168.2 U28.20(B1)
E_SFP4_SCL: CN8.5(SCL) R174.2 U28.15(B5)
E_SFP4_SDA: CN8.4(SDA) R176.2 U28.14(B6)
E_SFP4_TX_DIS: CN8.3(TX_DISABLE) U28.17(B3)
E_SFP4_TX_FAULT: CN8.2(TX_FAULT) R170.2 U28.18(B2)
SFP1_MOD_ABS: U25.5(A4) ; port SFP1_MOD_ABS
SFP1_RX_LOS: U25.1(A1) ; port SFP1_RX_LOS
SFP1_SCL: U25.6(A5) ; port SFP1_SCL
SFP1_SDA: U25.7(A6) ; port SFP1_SDA
SFP1_TX_DIS: U25.4(A3) ; port SFP1_TX_DIS
SFP1_TX_FAULT: U25.3(A2) ; port SFP1_TX_FAULT
SFP2_MOD_ABS: U26.5(A4) ; port SFP2_MOD_ABS
SFP2_RX_LOS: U26.1(A1) ; port SFP2_RX_LOS
SFP2_SCL: U26.6(A5) ; port SFP2_SCL
SFP2_SDA: U26.7(A6) ; port SFP2_SDA
SFP2_TX_DIS: U26.4(A3) ; port SFP2_TX_DIS
SFP2_TX_FAULT: U26.3(A2) ; port SFP2_TX_FAULT
SFP3_MOD_ABS: U27.5(A4) ; port SFP3_MOD_ABS
SFP3_RX_LOS: U27.1(A1) ; port SFP3_RX_LOS
SFP3_SCL: U27.6(A5) ; port SFP3_SCL
SFP3_SDA: U27.7(A6) ; port SFP3_SDA
SFP3_TX_DIS: U27.4(A3) ; port SFP3_TX_DIS
SFP3_TX_FAULT: U27.3(A2) ; port SFP3_TX_FAULT
SFP4_MOD_ABS: U28.5(A4) ; port SFP4_MOD_ABS
SFP4_RX_LOS: U28.1(A1) ; port SFP4_RX_LOS
SFP4_SCL: U28.6(A5) ; port SFP4_SCL
SFP4_SDA: U28.7(A6) ; port SFP4_SDA
SFP4_TX_DIS: U28.4(A3) ; port SFP4_TX_DIS
SFP4_TX_FAULT: U28.3(A2) ; port SFP4_TX_FAULT
SFP_ETH1_RX_N: CN5.12(RD_N) ; port SFP_ETH1_RX_N
SFP_ETH1_RX_P: CN5.13(RD_P) ; port SFP_ETH1_RX_P
SFP_ETH1_TX_N: CN5.19(TD_N) ; port SFP_ETH1_TX_N
SFP_ETH1_TX_P: CN5.18(TD_P) ; port SFP_ETH1_TX_P
SFP_ETH2_RX_N: CN6.12(RD_N) ; port SFP_ETH2_RX_N
SFP_ETH2_RX_P: CN6.13(RD_P) ; port SFP_ETH2_RX_P
SFP_ETH2_TX_N: CN6.19(TD_N) ; port SFP_ETH2_TX_N
SFP_ETH2_TX_P: CN6.18(TD_P) ; port SFP_ETH2_TX_P
SFP_ETH3_RX_N: CN7.12(RD_N) ; port SFP_ETH3_RX_N
SFP_ETH3_RX_P: CN7.13(RD_P) ; port SFP_ETH3_RX_P
SFP_ETH3_TX_N: CN7.19(TD_N) ; port SFP_ETH3_TX_N
SFP_ETH3_TX_P: CN7.18(TD_P) ; port SFP_ETH3_TX_P
SFP_ETH4_RX_N: CN8.12(RD_N) ; port SFP_ETH4_RX_N
SFP_ETH4_RX_P: CN8.13(RD_P) ; port SFP_ETH4_RX_P
SFP_ETH4_TX_N: CN8.19(TD_N) ; port SFP_ETH4_TX_N
SFP_ETH4_TX_P: CN8.18(TD_P) ; port SFP_ETH4_TX_P
VCCR_SFP_1: C212.1 C216.1 CN5.15(VCCR) L25.2
VCCR_SFP_2: C214.1 C218.1 CN6.15(VCCR) L26.2
VCCR_SFP_3: C228.1 C232.1 CN7.15(VCCR) L29.2
VCCR_SFP_4: C230.1 C234.1 CN8.15(VCCR) L30.2
VCCT_SFP_1: C207.1 C209.1 CN5.16(VCCT) L23.2
VCCT_SFP_2: C208.1 C210.1 CN6.16(VCCT) L24.2
VCCT_SFP_3: C223.1 C225.1 CN7.16(VCCT) L27.2
VCCT_SFP_4: C224.1 C226.1 CN8.16(VCCT) L28.2
NetR157_2: R157.2 U25.10(OE)
NetR158_2: R158.2 U26.10(OE)
NetR177_2: R177.2 U27.10(OE)
NetR178_2: R178.2 U28.10(OE)

Not connected (* = marked no-connect by the designer): U25 8(A7)* 9(A8)* 12(B8)* 13(B7)*; U26 8(A7)* 9(A8)* 12(B8)* 13(B7)*; U27 8(A7)* 9(A8)* 12(B8)* 13(B7)*; U28 8(A7)* 9(A8)* 12(B8)* 13(B7)*

### Library data of the parts
C207 C208 C211-C214 C223 C224 C227-C230 = Cap Aluminium Electrolytic: Aluminium Electrolytic Capacitor; RATED_VOLTAGE: 50V; Value: 22uF; Manufacturer Part Num: *
C209 C210 C215-C222 C225 C226 C231-C238 = Cap SMD: as C147-C150 on sheet [11] - MAIN CLOCKS; Value: 0.1uF; Manufacturer Part Num: *; Dielectric: *
CN5-CN8 = SFP+ Connector: SFP+ Host Connector, Z-Axis Pluggable, Right-Angle, Surface Mount, 20 Circuits , and EMI Cage; Value: SFP+ Connector; Manufacturer Part Num: *
L23-L30 = Inductor: Inductor SMD; Value: 1uH; Manufacturer Part Num: *
R139-R178 = Res SMD: SMD Resistor; Tolerance: 5%; Manufacturer Part Num: *
  R139-R142 R147-R156 R159-R162 R167-R176: Value: 4.7K
  R143-R146 R163-R166: Value: DNI
  R157 R158 R177 R178: Value: 10K
U25-U28 = TXS0108E: 8-Bit Bidirectional Voltage-Level Translator for Open-Drain and Push-Pull Applications; Manufacturer Part Num: TXS0108EPWR; Value: TXS0108E

## Sheet [14] - ETHERNET 10_100_1000.SchDoc
size A3; DocumentNumber: 14; SheetNumber: 14; SheetTotal: 15
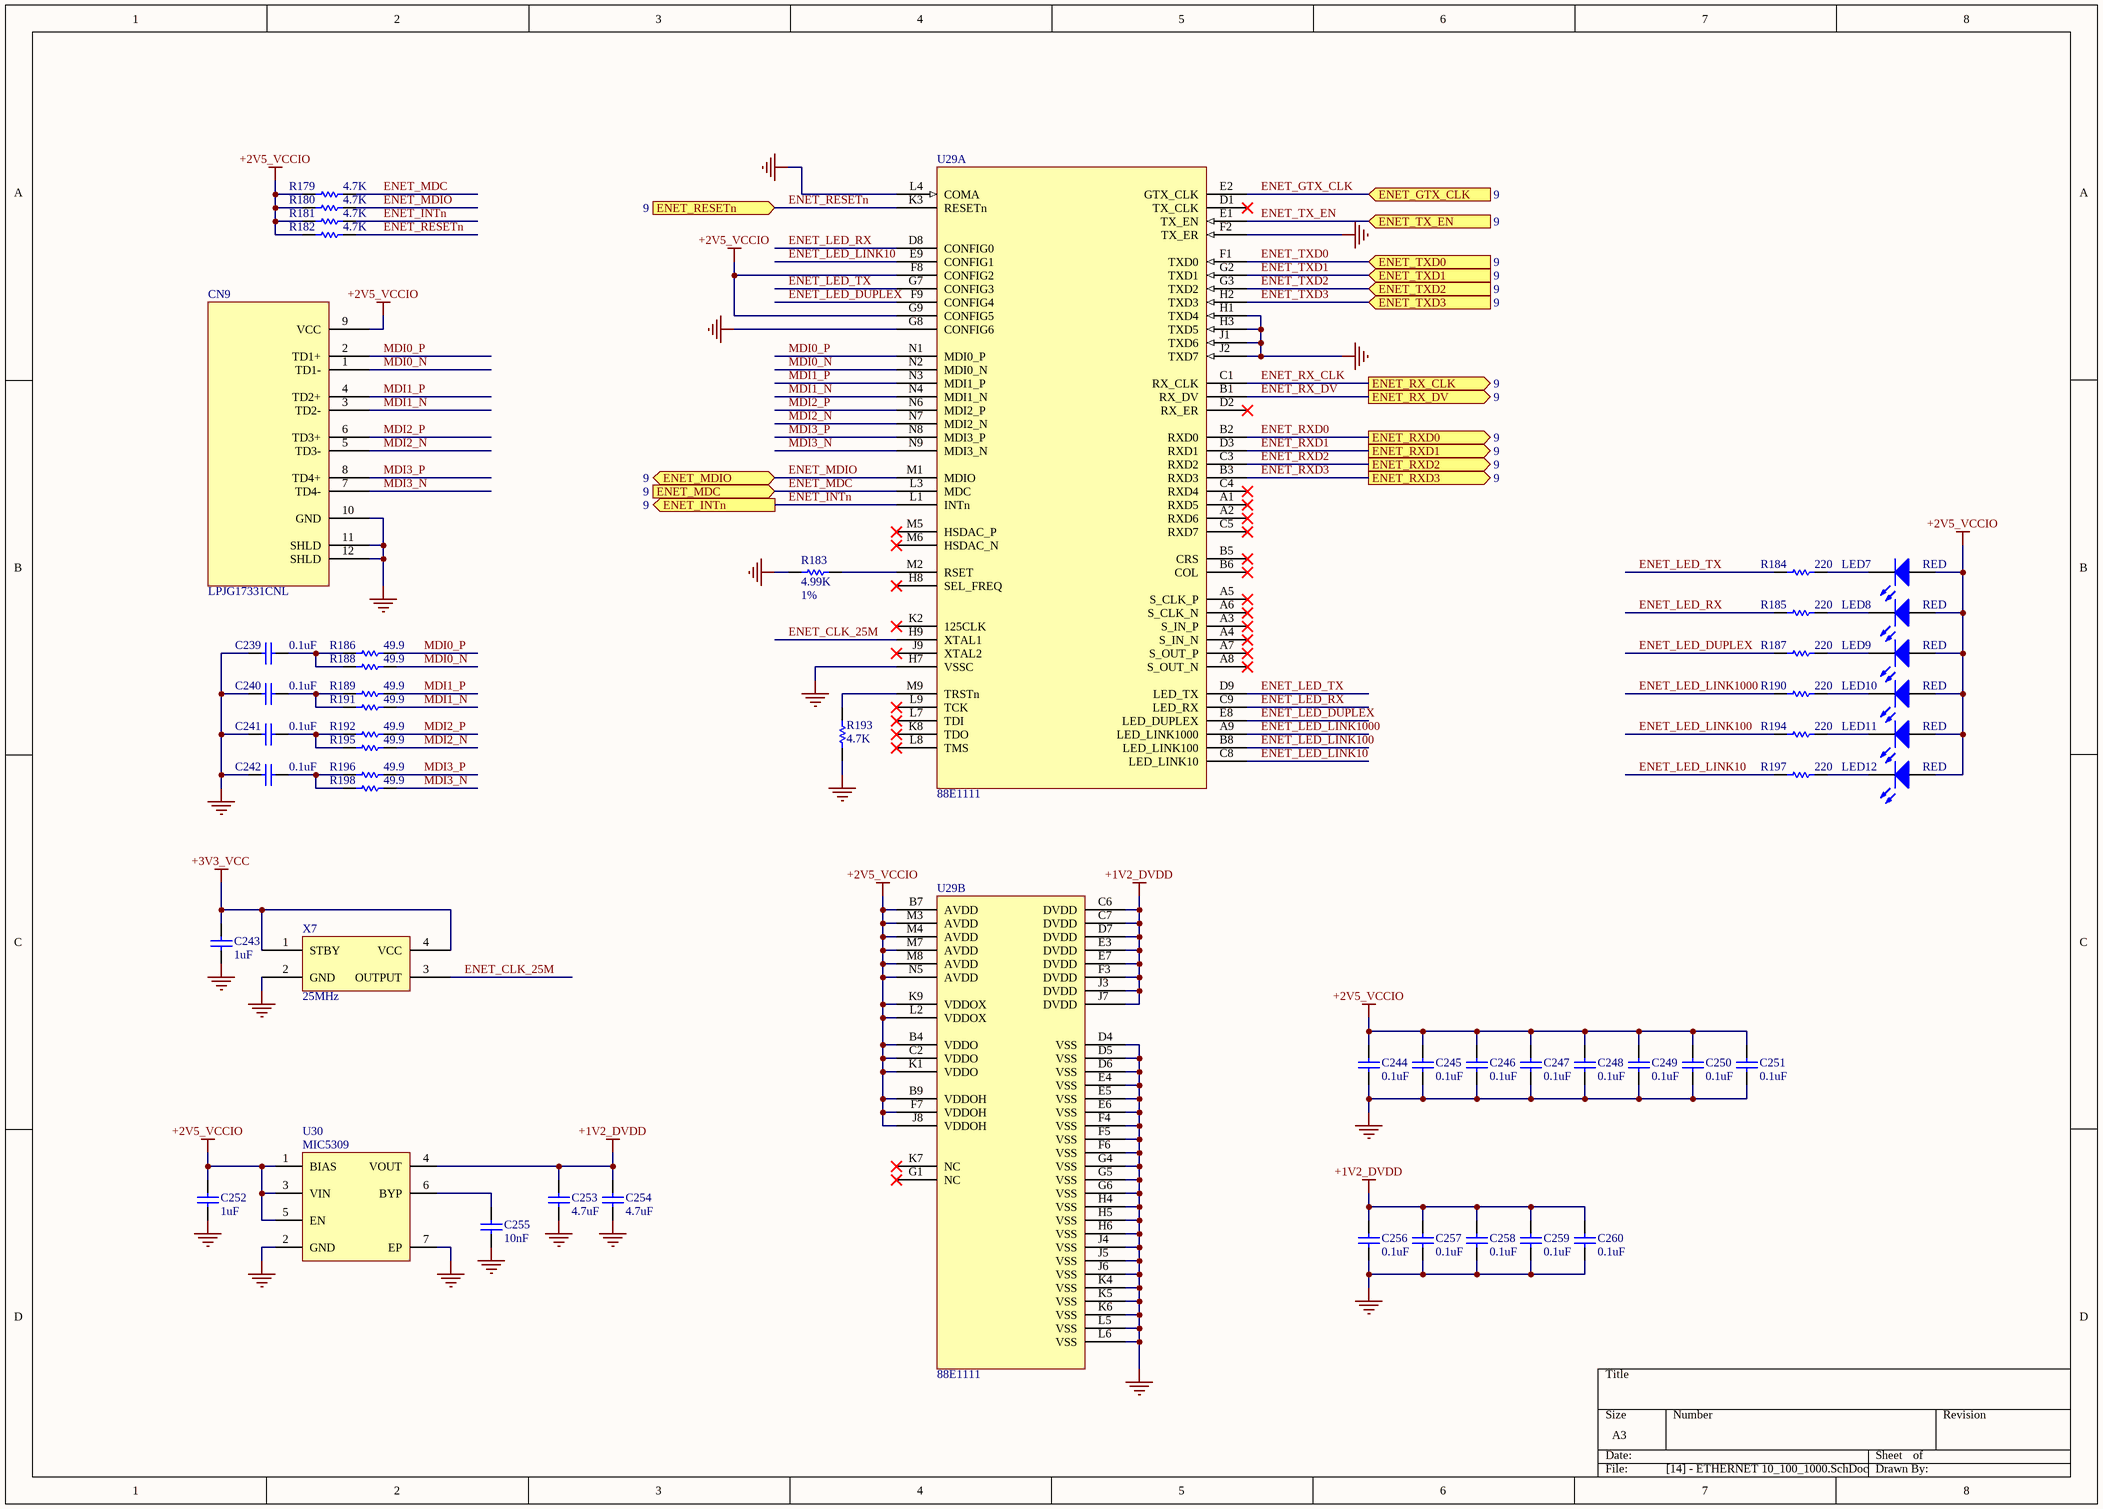
[diagram p13: [14] - ETHERNET 10_100_1000.SchDoc]

### Parts
C239  0.1uF  [0402_C]
C240  0.1uF  [0402_C]
C241  0.1uF  [0402_C]
C242  0.1uF  [0402_C]
C243  1uF  [0402_C]
C244  0.1uF  [0402_C]
C245  0.1uF  [0402_C]
C246  0.1uF  [0402_C]
C247  0.1uF  [0402_C]
C248  0.1uF  [0402_C]
C249  0.1uF  [0402_C]
C250  0.1uF  [0402_C]
C251  0.1uF  [0402_C]
C252  1uF  [0805_C]
C253  4.7uF  [0805_C]
C254  4.7uF  [0805_C]
C255  10nF  [0805_C]
C256  0.1uF  [0402_C]
C257  0.1uF  [0402_C]
C258  0.1uF  [0402_C]
C259  0.1uF  [0402_C]
C260  0.1uF  [0402_C]
CN9  LPJG17331CNL  [LPJG17331CNL]
LED7  RED  [LED_0603]
LED8  RED  [LED_0603]
LED9  RED  [LED_0603]
LED10  RED  [LED_0603]
LED11  RED  [LED_0603]
LED12  RED  [LED_0603]
R179  4.7K  [0402_R]
R180  4.7K  [0402_R]
R181  4.7K  [0402_R]
R182  4.7K  [0402_R]
R183  4.99K  Tolerance: 1%  [0402_R]
R184  220  [0805_R]
R185  220  [0805_R]
R186  49.9  [0402_R]
R187  220  [0805_R]
R188  49.9  [0402_R]
R189  49.9  [0402_R]
R190  220  [0805_R]
R191  49.9  [0402_R]
R192  49.9  [0402_R]
R193  4.7K  [0402_R]
R194  220  [0805_R]
R195  49.9  [0402_R]
R196  49.9  [0402_R]
R197  220  [0805_R]
R198  49.9  [0402_R]
U29  88E1111  (parts A,B of 2)
U30  MIC5309  [DFN-6]
X7  25MHz  [OSC_3.2x2.5]

### Ports
ENET_GTX_CLK (in, see 9), ENET_INTn (out, see 9), ENET_MDC (in, see 9), ENET_MDIO (bidir, see 9), ENET_RESETn (in, see 9), ENET_RX_CLK (out, see 9), ENET_RX_DV (out, see 9), ENET_RXD0 (out, see 9), ENET_RXD1 (out, see 9), ENET_RXD2 (out, see 9), ENET_RXD3 (out, see 9), ENET_TX_EN (in, see 9), ENET_TXD0 (in, see 9), ENET_TXD1 (in, see 9), ENET_TXD2 (in, see 9), ENET_TXD3 (in, see 9)

### Nets
+1V2_DVDD: C253.2 C254.2 C256.1 C257.1 C258.1 C259.1 C260.1 U29.C6(DVDD) U29.C7(DVDD) U29.D7(DVDD) U29.E3(DVDD) U29.E7(DVDD) U29.F3(DVDD) U29.J3(DVDD) U29.J7(DVDD) U30.4(VOUT)
+2V5_VCCIO: C244.1 C245.1 C246.1 C247.1 C248.1 C249.1 C250.1 C251.1 C252.2 CN9.9(VCC) LED7.1(A) LED8.1(A) LED9.1(A) LED10.1(A) LED11.1(A) LED12.1(A) R179.2 R180.2 R181.2 R182.2 U29.B4(VDDO) U29.B7(AVDD) U29.B9(VDDOH) U29.C2(VDDO) U29.F7(VDDOH) U29.F8(CONFIG2) U29.G9(CONFIG5) U29.J8(VDDOH) U29.K1(VDDO) U29.K9(VDDOX) U29.L2(VDDOX) U29.M3(AVDD) U29.M4(AVDD) U29.M7(AVDD) U29.M8(AVDD) U29.N5(AVDD) U30.1(BIAS) U30.3(VIN) U30.5(EN)
+3V3_VCC: C243.2 X7.1(STBY) X7.4(VCC)
GND: C239.1 C240.1 C241.1 C242.1 C243.1 C244.2 C245.2 C246.2 C247.2 C248.2 C249.2 C250.2 C251.2 C252.1 C253.1 C254.1 C255.1 C256.2 C257.2 C258.2 C259.2 C260.2 CN9.10(GND) CN9.11(SHLD) CN9.12(SHLD) R183.2 R193.1 U29.D4(VSS) U29.D5(VSS) U29.D6(VSS) U29.E4(VSS) U29.E5(VSS) U29.E6(VSS) U29.F2(TX_ER) U29.F4(VSS) U29.F5(VSS) U29.F6(VSS) U29.G4(VSS) U29.G5(VSS) U29.G6(VSS) U29.G8(CONFIG6) U29.H1(TXD4) U29.H3(TXD5) U29.H4(VSS) U29.H5(VSS) U29.H6(VSS) U29.H7(VSSC) U29.J1(TXD6) U29.J2(TXD7) U29.J4(VSS) U29.J5(VSS) U29.J6(VSS) U29.K4(VSS) U29.K5(VSS) U29.K6(VSS) U29.L4(COMA) U29.L5(VSS) U29.L6(VSS) U30.2(GND) U30.7(EP) X7.2(GND)
ENET_CLK_25M: U29.H9(XTAL1) X7.3(OUTPUT)
ENET_GTX_CLK: U29.E2(GTX_CLK) ; port ENET_GTX_CLK
ENET_INTn: R181.1 U29.L1(INTn) ; port ENET_INTn
ENET_LED_DUPLEX: R187.1 U29.E8(LED_DUPLEX) U29.F9(CONFIG4)
ENET_LED_LINK10: R197.1 U29.C8(LED_LINK10) U29.E9(CONFIG1)
ENET_LED_LINK100: R194.1 U29.B8(LED_LINK100)
ENET_LED_LINK1000: R190.1 U29.A9(LED_LINK1000)
ENET_LED_RX: R185.1 U29.C9(LED_RX) U29.D8(CONFIG0)
ENET_LED_TX: R184.1 U29.D9(LED_TX) U29.G7(CONFIG3)
ENET_MDC: R179.1 U29.L3(MDC) ; port ENET_MDC
ENET_MDIO: R180.1 U29.M1(MDIO) ; port ENET_MDIO
ENET_RESETn: R182.1 U29.K3(RESETn) ; port ENET_RESETn
ENET_RX_CLK: U29.C1(RX_CLK) ; port ENET_RX_CLK
ENET_RX_DV: U29.B1(RX_DV) ; port ENET_RX_DV
ENET_RXD0: U29.B2(RXD0) ; port ENET_RXD0
ENET_RXD1: U29.D3(RXD1) ; port ENET_RXD1
ENET_RXD2: U29.C3(RXD2) ; port ENET_RXD2
ENET_RXD3: U29.B3(RXD3) ; port ENET_RXD3
ENET_TX_EN: U29.E1(TX_EN) ; port ENET_TX_EN
ENET_TXD0: U29.F1(TXD0) ; port ENET_TXD0
ENET_TXD1: U29.G2(TXD1) ; port ENET_TXD1
ENET_TXD2: U29.G3(TXD2) ; port ENET_TXD2
ENET_TXD3: U29.H2(TXD3) ; port ENET_TXD3
MDI0_N: CN9.1(TD1-) R188.1 U29.N2(MDI0_N)
MDI0_P: CN9.2(TD1+) R186.1 U29.N1(MDI0_P)
MDI1_N: CN9.3(TD2-) R191.1 U29.N4(MDI1_N)
MDI1_P: CN9.4(TD2+) R189.1 U29.N3(MDI1_P)
MDI2_N: CN9.5(TD3-) R195.1 U29.N7(MDI2_N)
MDI2_P: CN9.6(TD3+) R192.1 U29.N6(MDI2_P)
MDI3_N: CN9.7(TD4-) R198.1 U29.N9(MDI3_N)
MDI3_P: CN9.8(TD4+) R196.1 U29.N8(MDI3_P)
NetC239_2: C239.2 R186.2 R188.2
NetC240_2: C240.2 R189.2 R191.2
NetC241_2: C241.2 R192.2 R195.2
NetC242_2: C242.2 R196.2 R198.2
NetC255_2: C255.2 U30.6(BYP)
NetLED7_2: LED7.2(K) R184.2
NetLED8_2: LED8.2(K) R185.2
NetLED9_2: LED9.2(K) R187.2
NetLED10_2: LED10.2(K) R190.2
NetLED11_2: LED11.2(K) R194.2
NetLED12_2: LED12.2(K) R197.2
NetR183_1: R183.1 U29.M2(RSET)
NetR193_2: R193.2 U29.M9(TRSTn)

Not connected (* = marked no-connect by the designer): U29 A1(RXD5)* A2(RXD6)* A3(S_IN_P)* A4(S_IN_N)* A5(S_CLK_P)* A6(S_CLK_N)* A7(S_OUT_P)* A8(S_OUT_N)* B5(CRS)* B6(COL)* C4(RXD4)* C5(RXD7)* D1(TX_CLK)* D2(RX_ER)* G1(NC)* H8(SEL_FREQ)* J9(XTAL2)* K2(125CLK)* K7(NC)* K8(TDO)* L7(TDI)* L8(TMS)* L9(TCK)* M5(HSDAC_P)* M6(HSDAC_N)*

### Library data of the parts
C239-C251 C256-C260 = Cap SMD: as C147-C150 on sheet [11] - MAIN CLOCKS; Manufacturer Part Num: *; Dielectric: *
  C239-C242 C244-C251 C256-C260: Value: 0.1uF
  C243: Value: 1uF
C252-C255 = Cap SMD: as C155-C158 on sheet [11] - MAIN CLOCKS; Manufacturer Part Num: *; Dielectric: *
  C252: Value: 1uF
  C253 C254: Value: 4.7uF
  C255: Value: 10nF
CN9 = LPJG17331CNL: 100/1000 Base-T Modular jack RJ45 With Transformer Tab Up Without Led; Value: LPJG17331CNL; Manufacturer Part Num: LPJG17331CNL
LED7-LED12 = LED: Typical LED; Value: RED
R179-R182 R184-R198 = Res SMD: SMD Resistor; Tolerance: 5%; Manufacturer Part Num: *
  R179-R182 R193: Value: 4.7K
  R184 R185 R187 R190 R194 R197: Value: 220
  R186 R188 R189 R191 R192 R195 R196 R198: Value: 49.9
R183 = Res SMD: SMD Resistor; Value: 4.99K; Manufacturer Part Num: *
U29 = 88E1111: Integrated 10/100/1000 Ultra Gigabit Ethernet Transceiver; Value: 88E1111; Manufacturer Part Num: *
U30 = MIC5309: Low Vin/Vout 300mA High PSRR ULDO with Ultra-Low IQ; Manufacturer Part Num: MIC5309-1.2YMT; Value: MIC5309
X7 = XTAL OSC: Crystal Oscillator; Value: 25MHz

## Nets that join several sheets
+0V9_VCC_CORE: [01] - PWR 0V9, PWR SEQ (R2.2), [05] - FPGA PWR (76 pins)
+1V0_VCC_XCVR: [03] - PWR 3V3, 1V0 (R41.2), [05] - FPGA PWR (23 pins)
+1V8_VCCH_GXB: [02] - PWR 1V8 (R23.2), [05] - FPGA PWR (8 pins)
+1V8_VCCIO: [04] - PWR 2V5, 1V8, 1V35 (R53.2), [05] - FPGA PWR (26 pins), [06] - FPGA CONFIG, TEMP MON (15 pins), [08] - FPGA - DDR3 (5 pins), [09] - FPGA IO BANK 2A, 2L (L8.1), [11] - MAIN CLOCKS (L10.2 L12.2 U19.5), [12] - REFERENCE CLOCKS (8 pins), [13] - SFP+ MODULES (12 pins)
+1V35_VCCIO: [04] - PWR 2V5, 1V8, 1V35 (R61.2), [05] - FPGA PWR (13 pins), [08] - FPGA - DDR3 (30 pins)
+2V5_VCCIO: [04] - PWR 2V5, 1V8, 1V35 (R69.2), [05] - FPGA PWR (7 pins), [11] - MAIN CLOCKS (C155.2 C158.1 U19.1 U20.1), [14] - ETHERNET 10_100_1000 (39 pins)
+3V3_VCC: [01] - PWR 0V9, PWR SEQ (6 pins), [03] - PWR 3V3, 1V0 (R27.2 R31.2), [06] - FPGA CONFIG, TEMP MON (9 pins), [11] - MAIN CLOCKS (8 pins), [13] - SFP+ MODULES (36 pins), [14] - ETHERNET 10_100_1000 (C243.2 X7.1 X7.4)
+12V0_VCC: [01] - PWR 0V9, PWR SEQ (10 pins), [02] - PWR 1V8 (C14.2 C15.2 R17.2 U3.2), [03] - PWR 3V3, 1V0 (7 pins), [04] - PWR 2V5, 1V8, 1V35 (9 pins)
GND: [01] - PWR 0V9, PWR SEQ (29 pins), [02] - PWR 1V8 (15 pins), [03] - PWR 3V3, 1V0 (19 pins), [04] - PWR 2V5, 1V8, 1V35 (27 pins), [05] - FPGA PWR (259 pins), [06] - FPGA CONFIG, TEMP MON (20 pins), [07] - FPGA XCVR (R95.2 R96.2), [08] - FPGA - DDR3 (39 pins), [09] - FPGA IO BANK 2A, 2L (8 pins), [11] - MAIN CLOCKS (37 pins), [12] - REFERENCE CLOCKS (64 pins), [13] - SFP+ MODULES (148 pins), [14] - ETHERNET 10_100_1000 (61 pins)
CLK_1_SCL: [09] - FPGA IO BANK 2A, 2L (U10.AF4), [12] - REFERENCE CLOCKS (R127.1 U21.12)
CLK_1_SDA: [09] - FPGA IO BANK 2A, 2L (U10.AE7), [12] - REFERENCE CLOCKS (R128.1 U21.19)
CLK_2_SCL: [09] - FPGA IO BANK 2A, 2L (U10.AE6), [12] - REFERENCE CLOCKS (R130.1 U22.12)
CLK_2_SDA: [09] - FPGA IO BANK 2A, 2L (U10.AF3), [12] - REFERENCE CLOCKS (R131.1 U22.19)
CLK_3_SCL: [09] - FPGA IO BANK 2A, 2L (U10.AF8), [12] - REFERENCE CLOCKS (R133.1 U23.12)
CLK_3_SDA: [09] - FPGA IO BANK 2A, 2L (U10.AF6), [12] - REFERENCE CLOCKS (R134.1 U23.19)
CLK_4_SCL: [09] - FPGA IO BANK 2A, 2L (U10.AC8), [12] - REFERENCE CLOCKS (R136.1 U24.12)
CLK_4_SDA: [09] - FPGA IO BANK 2A, 2L (U10.AF7), [12] - REFERENCE CLOCKS (R137.1 U24.19)
CLK_50M_1: [09] - FPGA IO BANK 2A, 2L (U10.AA14), [11] - MAIN CLOCKS (R114.2)
CLK_50M_2: [10] - FPGA IO BANK 3A (U10.R5), [11] - MAIN CLOCKS (R119.2)
CLK_156p25M_1_N: [09] - FPGA IO BANK 2A, 2L (U10.AC5), [11] - MAIN CLOCKS (U17.14)
CLK_156p25M_1_P: [09] - FPGA IO BANK 2A, 2L (U10.AD5), [11] - MAIN CLOCKS (U17.15)
CLK_156p25M_2_N: [10] - FPGA IO BANK 3A (U10.M3), [11] - MAIN CLOCKS (U17.11)
CLK_156p25M_2_P: [10] - FPGA IO BANK 3A (U10.L3), [11] - MAIN CLOCKS (U17.12)
CLK_DDR_SCL: [08] - FPGA - DDR3 (R200.1 U15.8), [09] - FPGA IO BANK 2A, 2L (U10.Y9)
CLK_DDR_SDA: [08] - FPGA - DDR3 (R199.1 U15.7), [09] - FPGA IO BANK 2A, 2L (U10.W10)
CLK_OUT_1: [09] - FPGA IO BANK 2A, 2L (R105.2), [12] - REFERENCE CLOCKS (U21.3)
CLK_OUT_2: [09] - FPGA IO BANK 2A, 2L (R103.2), [12] - REFERENCE CLOCKS (U22.3)
CLK_OUT_3: [10] - FPGA IO BANK 3A (R112.2), [12] - REFERENCE CLOCKS (U23.3)
CLK_OUT_4: [10] - FPGA IO BANK 3A (R111.2), [12] - REFERENCE CLOCKS (U24.3)
ENET_GTX_CLK: [09] - FPGA IO BANK 2A, 2L (U10.E5), [14] - ETHERNET 10_100_1000 (U29.E2)
ENET_INTn: [09] - FPGA IO BANK 2A, 2L (U10.C7), [14] - ETHERNET 10_100_1000 (R181.1 U29.L1)
ENET_MDC: [09] - FPGA IO BANK 2A, 2L (U10.C8), [14] - ETHERNET 10_100_1000 (R179.1 U29.L3)
ENET_MDIO: [09] - FPGA IO BANK 2A, 2L (U10.E10), [14] - ETHERNET 10_100_1000 (R180.1 U29.M1)
ENET_RESETn: [09] - FPGA IO BANK 2A, 2L (U10.E11), [14] - ETHERNET 10_100_1000 (R182.1 U29.K3)
ENET_RX_CLK: [09] - FPGA IO BANK 2A, 2L (U10.F3), [14] - ETHERNET 10_100_1000 (U29.C1)
ENET_RX_DV: [09] - FPGA IO BANK 2A, 2L (U10.G5), [14] - ETHERNET 10_100_1000 (U29.B1)
ENET_RXD0: [09] - FPGA IO BANK 2A, 2L (U10.G4), [14] - ETHERNET 10_100_1000 (U29.B2)
ENET_RXD1: [09] - FPGA IO BANK 2A, 2L (U10.F8), [14] - ETHERNET 10_100_1000 (U29.D3)
ENET_RXD2: [09] - FPGA IO BANK 2A, 2L (U10.F7), [14] - ETHERNET 10_100_1000 (U29.C3)
ENET_RXD3: [09] - FPGA IO BANK 2A, 2L (U10.E9), [14] - ETHERNET 10_100_1000 (U29.B3)
ENET_TX_EN: [09] - FPGA IO BANK 2A, 2L (U10.E4), [14] - ETHERNET 10_100_1000 (U29.E1)
ENET_TXD0: [09] - FPGA IO BANK 2A, 2L (U10.D5), [14] - ETHERNET 10_100_1000 (U29.F1)
ENET_TXD1: [09] - FPGA IO BANK 2A, 2L (U10.D4), [14] - ETHERNET 10_100_1000 (U29.G2)
ENET_TXD2: [09] - FPGA IO BANK 2A, 2L (U10.E7), [14] - ETHERNET 10_100_1000 (U29.G3)
ENET_TXD3: [09] - FPGA IO BANK 2A, 2L (U10.E6), [14] - ETHERNET 10_100_1000 (U29.H2)
PWR_G2_EN: [01] - PWR 0V9, PWR SEQ (R12.1 TP6.1 U2.7), [03] - PWR 3V3, 1V0 (R49.1 U6.12)
PWR_G3_EN: [01] - PWR 0V9, PWR SEQ (R13.1 TP7.1 U2.6), [02] - PWR 1V8 (R25.1 U4.5), [04] - PWR 2V5, 1V8, 1V35 (U7.6 U8.6 U9.6)
REF_CLK_Q1_N: [07] - FPGA XCVR (U10.U21), [12] - REFERENCE CLOCKS (C181.2)
REF_CLK_Q1_P: [07] - FPGA XCVR (U10.U22), [12] - REFERENCE CLOCKS (C179.2)
REF_CLK_Q2_N: [07] - FPGA XCVR (U10.R21), [12] - REFERENCE CLOCKS (C182.2)
REF_CLK_Q2_P: [07] - FPGA XCVR (U10.R22), [12] - REFERENCE CLOCKS (C180.2)
REF_CLK_Q3_N: [07] - FPGA XCVR (U10.N21), [12] - REFERENCE CLOCKS (C205.2)
REF_CLK_Q3_P: [07] - FPGA XCVR (U10.N22), [12] - REFERENCE CLOCKS (C203.2)
REF_CLK_Q4_N: [07] - FPGA XCVR (U10.L21), [12] - REFERENCE CLOCKS (C206.2)
REF_CLK_Q4_P: [07] - FPGA XCVR (U10.L22), [12] - REFERENCE CLOCKS (C204.2)
SFP1_MOD_ABS: [09] - FPGA IO BANK 2A, 2L (U10.W8), [13] - SFP+ MODULES (U25.5)
SFP1_RX_LOS: [09] - FPGA IO BANK 2A, 2L (U10.AA9), [13] - SFP+ MODULES (U25.1)
SFP1_SCL: [09] - FPGA IO BANK 2A, 2L (U10.AA13), [13] - SFP+ MODULES (U25.6)
SFP1_SDA: [09] - FPGA IO BANK 2A, 2L (U10.AA12), [13] - SFP+ MODULES (U25.7)
SFP1_TX_DIS: [09] - FPGA IO BANK 2A, 2L (U10.W9), [13] - SFP+ MODULES (U25.4)
SFP1_TX_FAULT: [09] - FPGA IO BANK 2A, 2L (U10.AB8), [13] - SFP+ MODULES (U25.3)
SFP2_MOD_ABS: [10] - FPGA IO BANK 3A (U10.H5), [13] - SFP+ MODULES (U26.5)
SFP2_RX_LOS: [10] - FPGA IO BANK 3A (U10.K4), [13] - SFP+ MODULES (U26.1)
SFP2_SCL: [10] - FPGA IO BANK 3A (U10.K5), [13] - SFP+ MODULES (U26.6)
SFP2_SDA: [10] - FPGA IO BANK 3A (U10.J5), [13] - SFP+ MODULES (U26.7)
SFP2_TX_DIS: [10] - FPGA IO BANK 3A (U10.H6), [13] - SFP+ MODULES (U26.4)
SFP2_TX_FAULT: [10] - FPGA IO BANK 3A (U10.J4), [13] - SFP+ MODULES (U26.3)
SFP3_MOD_ABS: [10] - FPGA IO BANK 3A (U10.N5), [13] - SFP+ MODULES (U27.5)
SFP3_RX_LOS: [10] - FPGA IO BANK 3A (U10.L4), [13] - SFP+ MODULES (U27.1)
SFP3_SCL: [10] - FPGA IO BANK 3A (U10.M5), [13] - SFP+ MODULES (U27.6)
SFP3_SDA: [10] - FPGA IO BANK 3A (U10.J3), [13] - SFP+ MODULES (U27.7)
SFP3_TX_DIS: [10] - FPGA IO BANK 3A (U10.G3), [13] - SFP+ MODULES (U27.4)
SFP3_TX_FAULT: [10] - FPGA IO BANK 3A (U10.H3), [13] - SFP+ MODULES (U27.3)
SFP4_MOD_ABS: [10] - FPGA IO BANK 3A (U10.T4), [13] - SFP+ MODULES (U28.5)
SFP4_RX_LOS: [10] - FPGA IO BANK 3A (U10.U5), [13] - SFP+ MODULES (U28.1)
SFP4_SCL: [10] - FPGA IO BANK 3A (U10.T2), [13] - SFP+ MODULES (U28.6)
SFP4_SDA: [10] - FPGA IO BANK 3A (U10.T1), [13] - SFP+ MODULES (U28.7)
SFP4_TX_DIS: [10] - FPGA IO BANK 3A (U10.R4), [13] - SFP+ MODULES (U28.4)
SFP4_TX_FAULT: [10] - FPGA IO BANK 3A (U10.U4), [13] - SFP+ MODULES (U28.3)
SFP_ETH1_RX_N: [07] - FPGA XCVR (U10.AD23), [13] - SFP+ MODULES (CN5.12)
SFP_ETH1_RX_P: [07] - FPGA XCVR (U10.AD24), [13] - SFP+ MODULES (CN5.13)
SFP_ETH1_TX_N: [07] - FPGA XCVR (U10.AE25), [13] - SFP+ MODULES (CN5.19)
SFP_ETH1_TX_P: [07] - FPGA XCVR (U10.AE26), [13] - SFP+ MODULES (CN5.18)
SFP_ETH2_RX_N: [07] - FPGA XCVR (U10.Y23), [13] - SFP+ MODULES (CN6.12)
SFP_ETH2_RX_P: [07] - FPGA XCVR (U10.Y24), [13] - SFP+ MODULES (CN6.13)
SFP_ETH2_TX_N: [07] - FPGA XCVR (U10.AA25), [13] - SFP+ MODULES (CN6.19)
SFP_ETH2_TX_P: [07] - FPGA XCVR (U10.AA26), [13] - SFP+ MODULES (CN6.18)
SFP_ETH3_RX_N: [07] - FPGA XCVR (U10.M23), [13] - SFP+ MODULES (CN7.12)
SFP_ETH3_RX_P: [07] - FPGA XCVR (U10.M24), [13] - SFP+ MODULES (CN7.13)
SFP_ETH3_TX_N: [07] - FPGA XCVR (U10.N25), [13] - SFP+ MODULES (CN7.19)
SFP_ETH3_TX_P: [07] - FPGA XCVR (U10.N26), [13] - SFP+ MODULES (CN7.18)
SFP_ETH4_RX_N: [07] - FPGA XCVR (U10.H23), [13] - SFP+ MODULES (CN8.12)
SFP_ETH4_RX_P: [07] - FPGA XCVR (U10.H24), [13] - SFP+ MODULES (CN8.13)
SFP_ETH4_TX_N: [07] - FPGA XCVR (U10.J25), [13] - SFP+ MODULES (CN8.19)
SFP_ETH4_TX_P: [07] - FPGA XCVR (U10.J26), [13] - SFP+ MODULES (CN8.18)
SMA_CLK_IN: [09] - FPGA IO BANK 2A, 2L (U10.C5), [11] - MAIN CLOCKS (R126.2)
SMA_CLK_OUT: [09] - FPGA IO BANK 2A, 2L (R104.2), [11] - MAIN CLOCKS (U19.3)
TEMP_ALERT_n: [06] - FPGA CONFIG, TEMP MON (U13.5), [09] - FPGA IO BANK 2A, 2L (U10.AE9)
TEMP_I2C_CLK: [06] - FPGA CONFIG, TEMP MON (U13.2), [09] - FPGA IO BANK 2A, 2L (U10.AE5)
TEMP_I2C_DATA: [06] - FPGA CONFIG, TEMP MON (U13.3), [09] - FPGA IO BANK 2A, 2L (U10.AE4)
TEMP_OVERT_n: [06] - FPGA CONFIG, TEMP MON (U13.4), [09] - FPGA IO BANK 2A, 2L (U10.AD9)